# EAGLE schematic FDT_BIG_Jly21 (EAGLE 7.6.0)
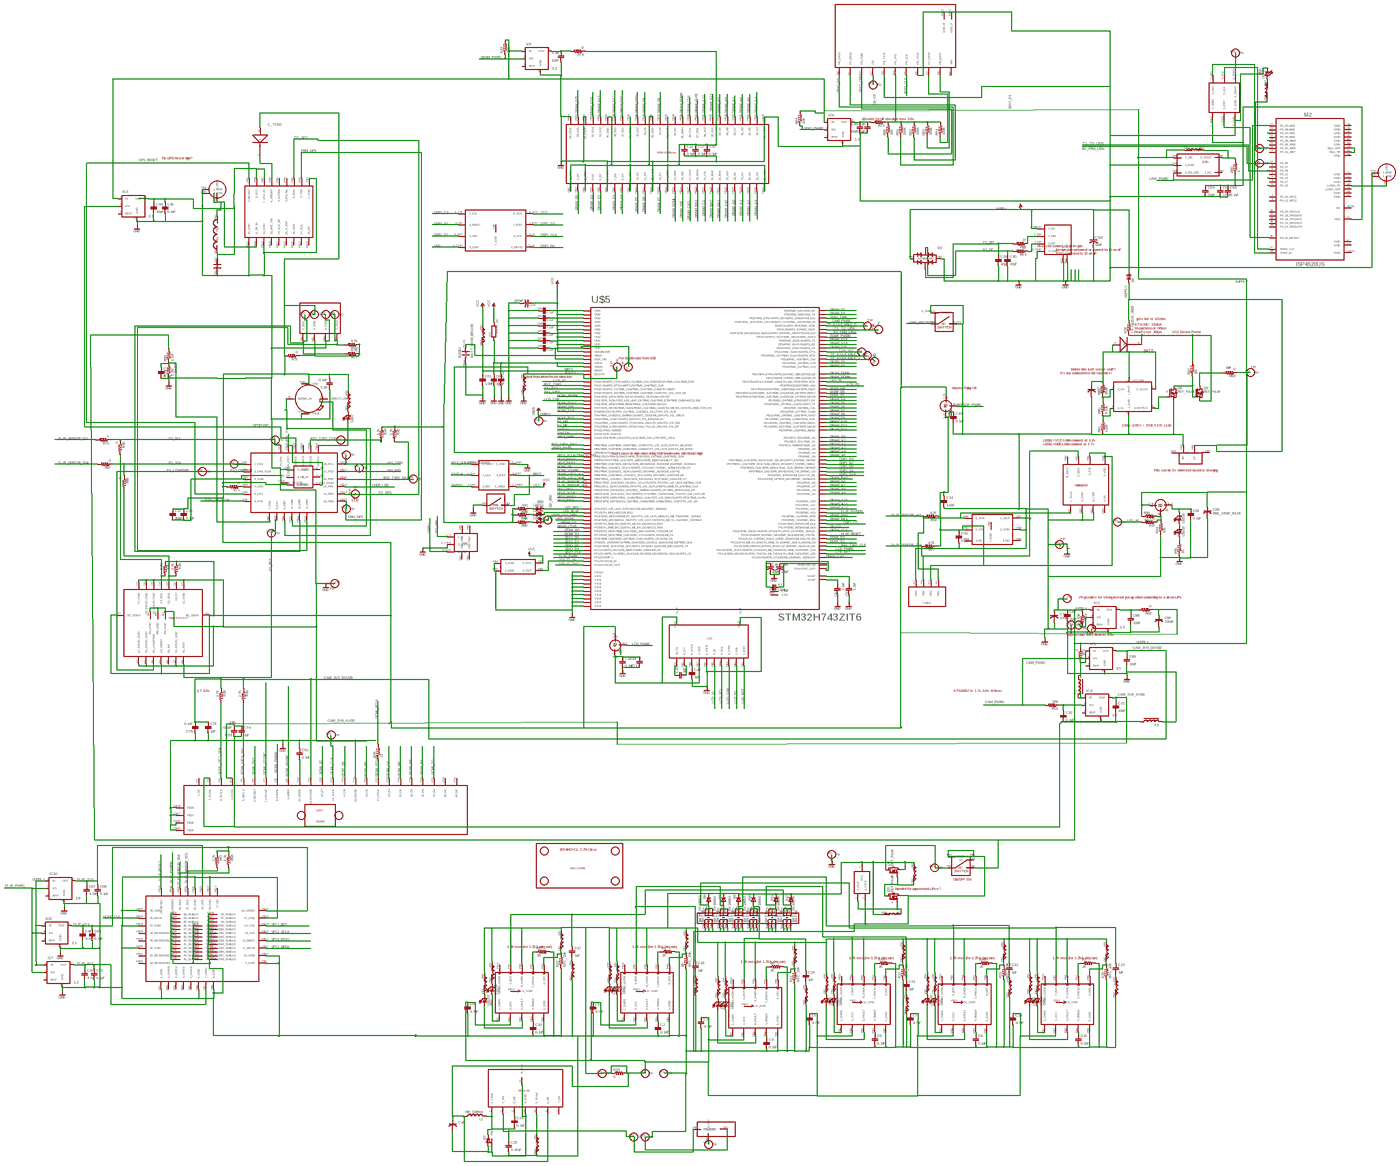
[diagram p0: schematic, sheet 1, overview]
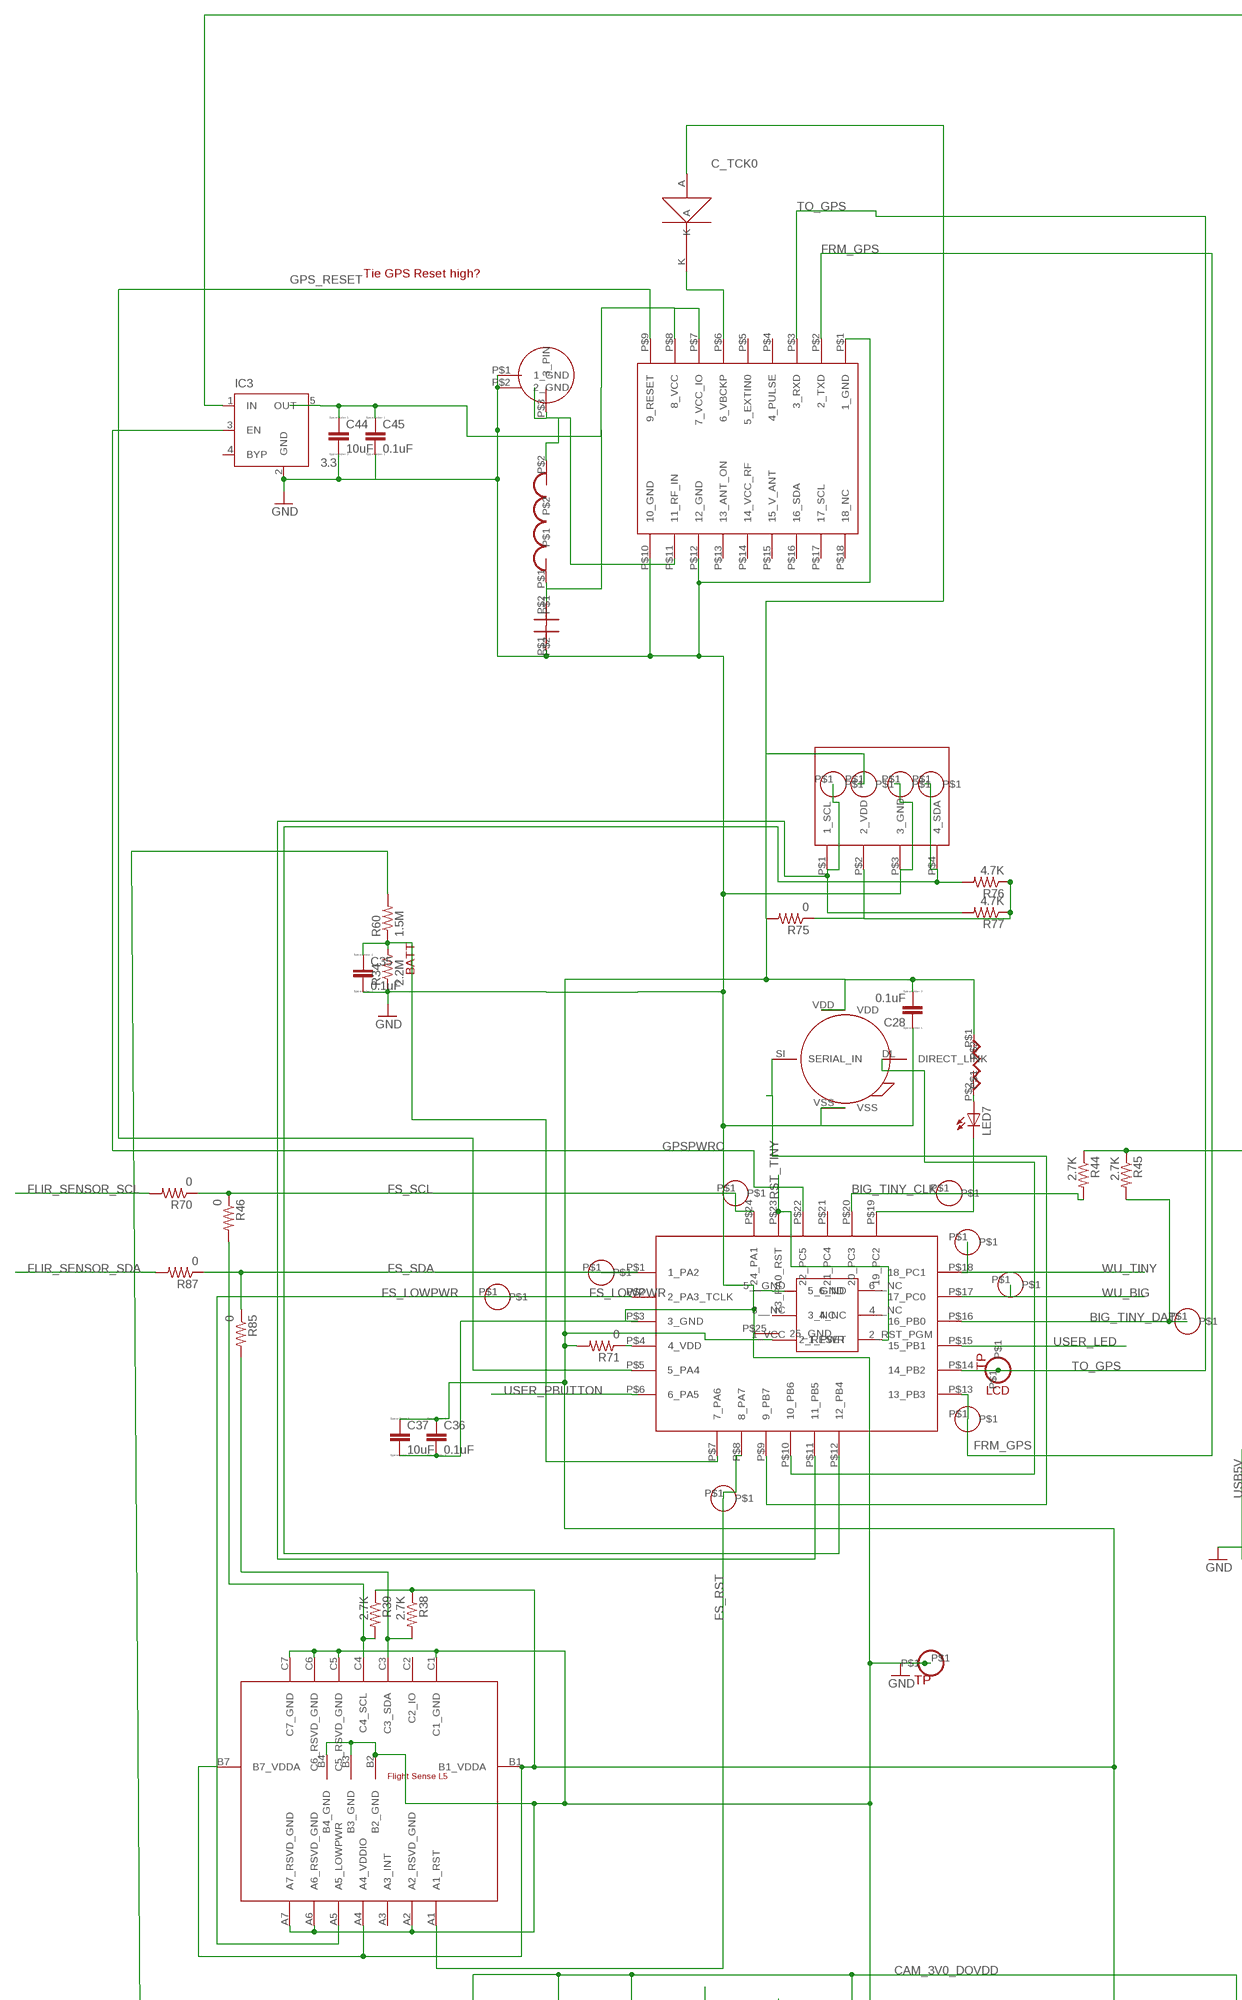
[diagram p1: schematic, sheet 1, part 1 of 6]
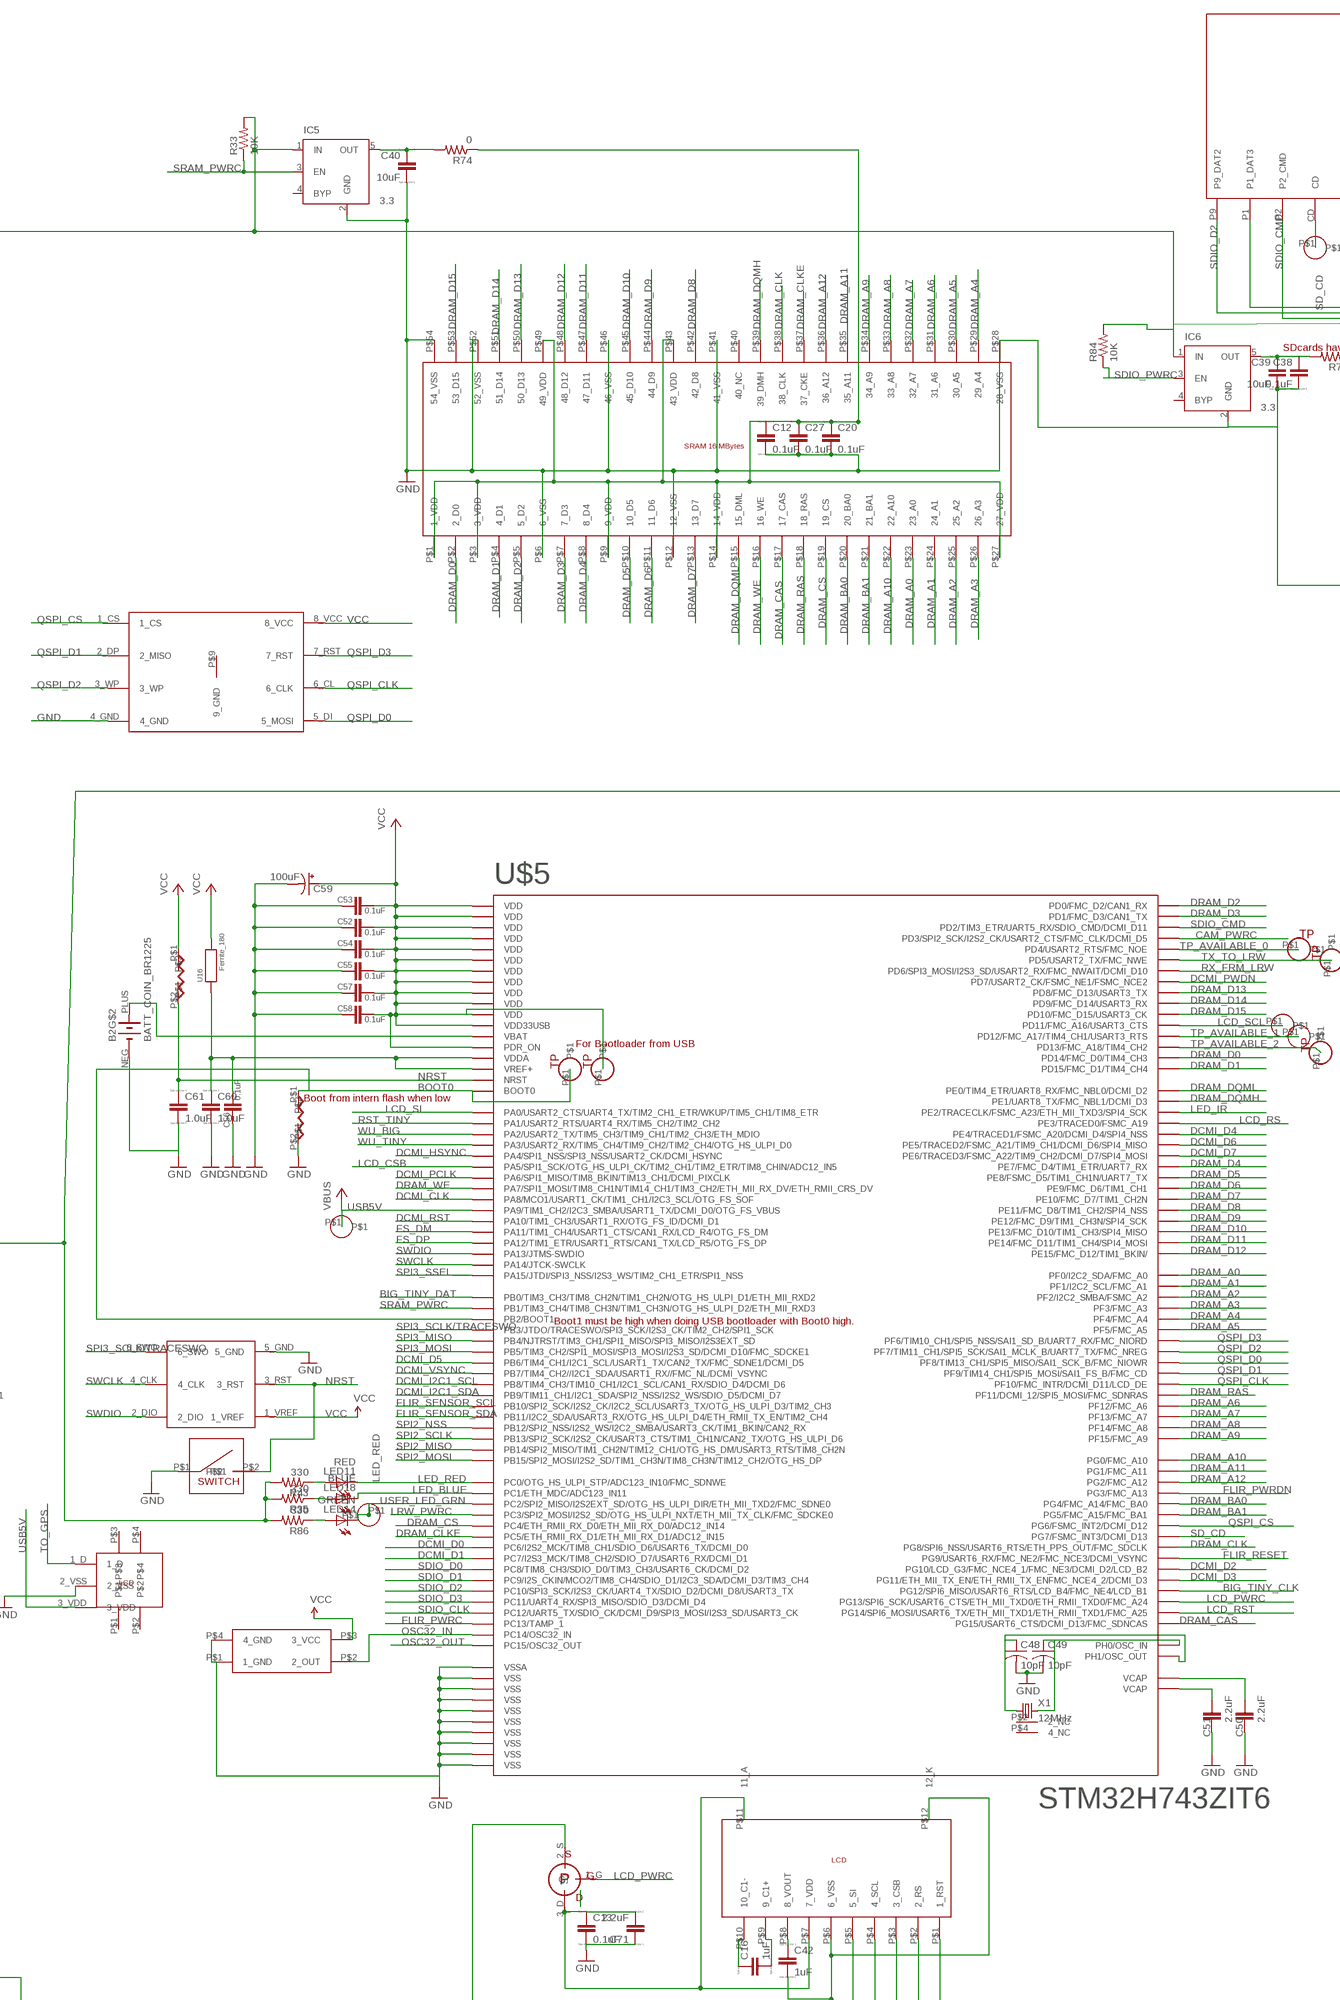
[diagram p2: schematic, sheet 1, part 2 of 6]
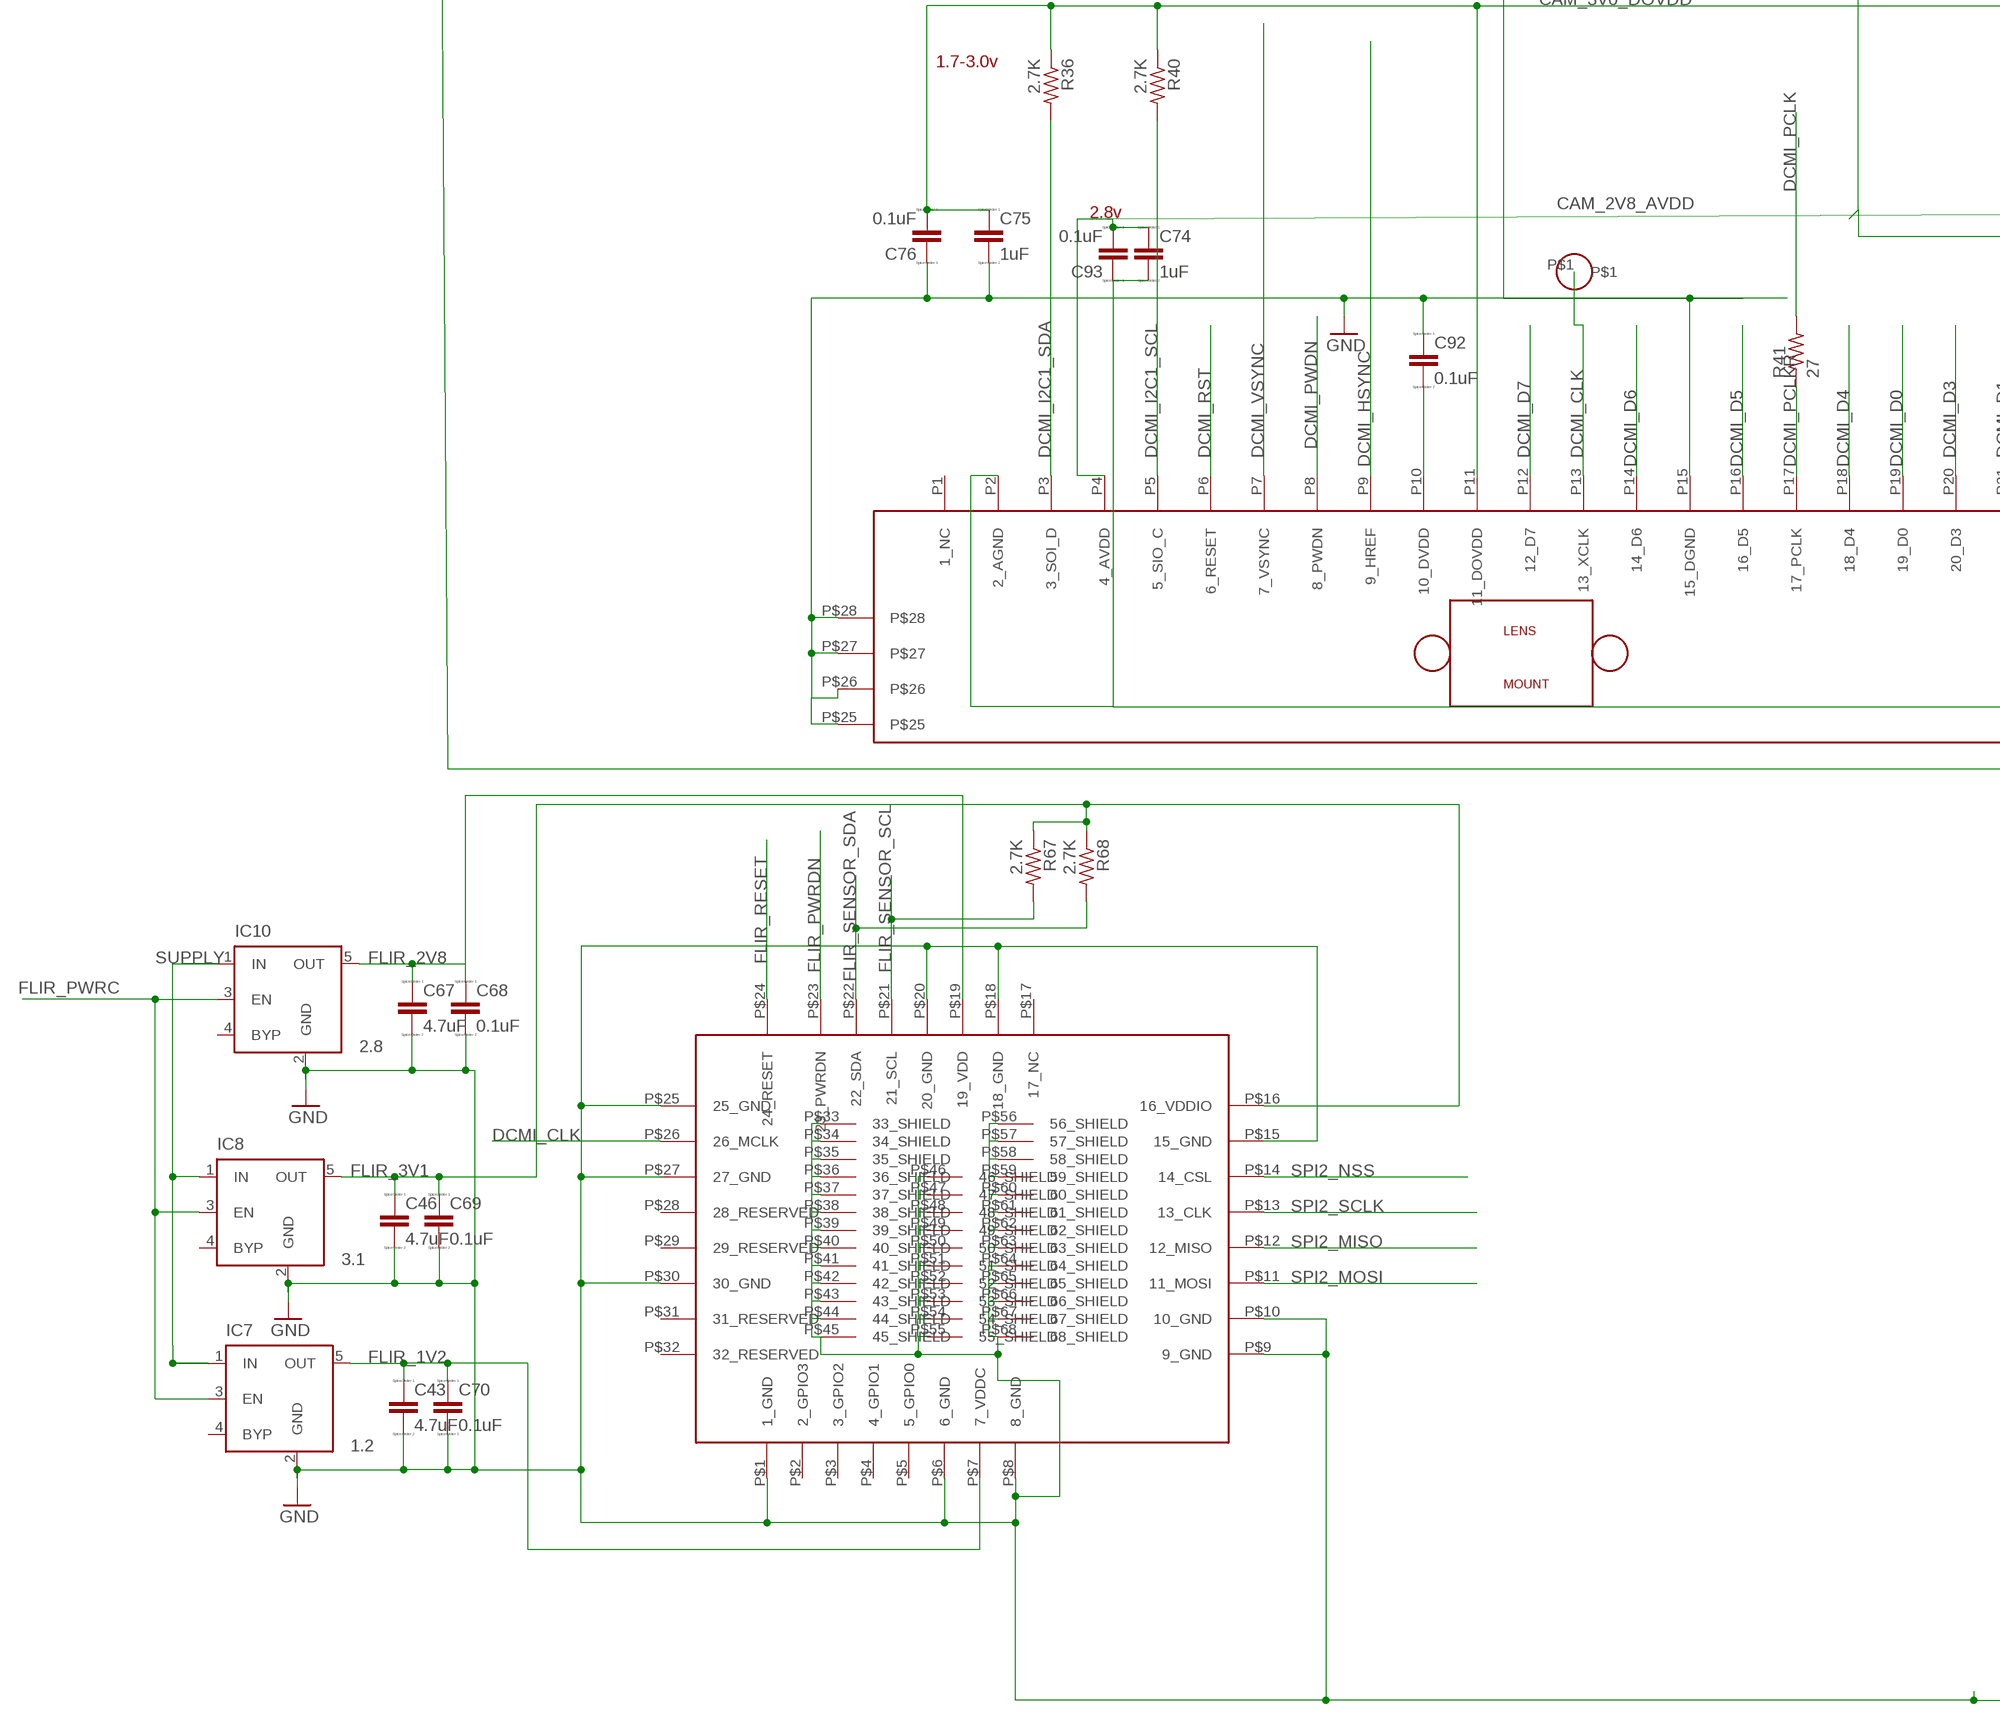
[diagram p3: schematic, sheet 1, part 3 of 6]
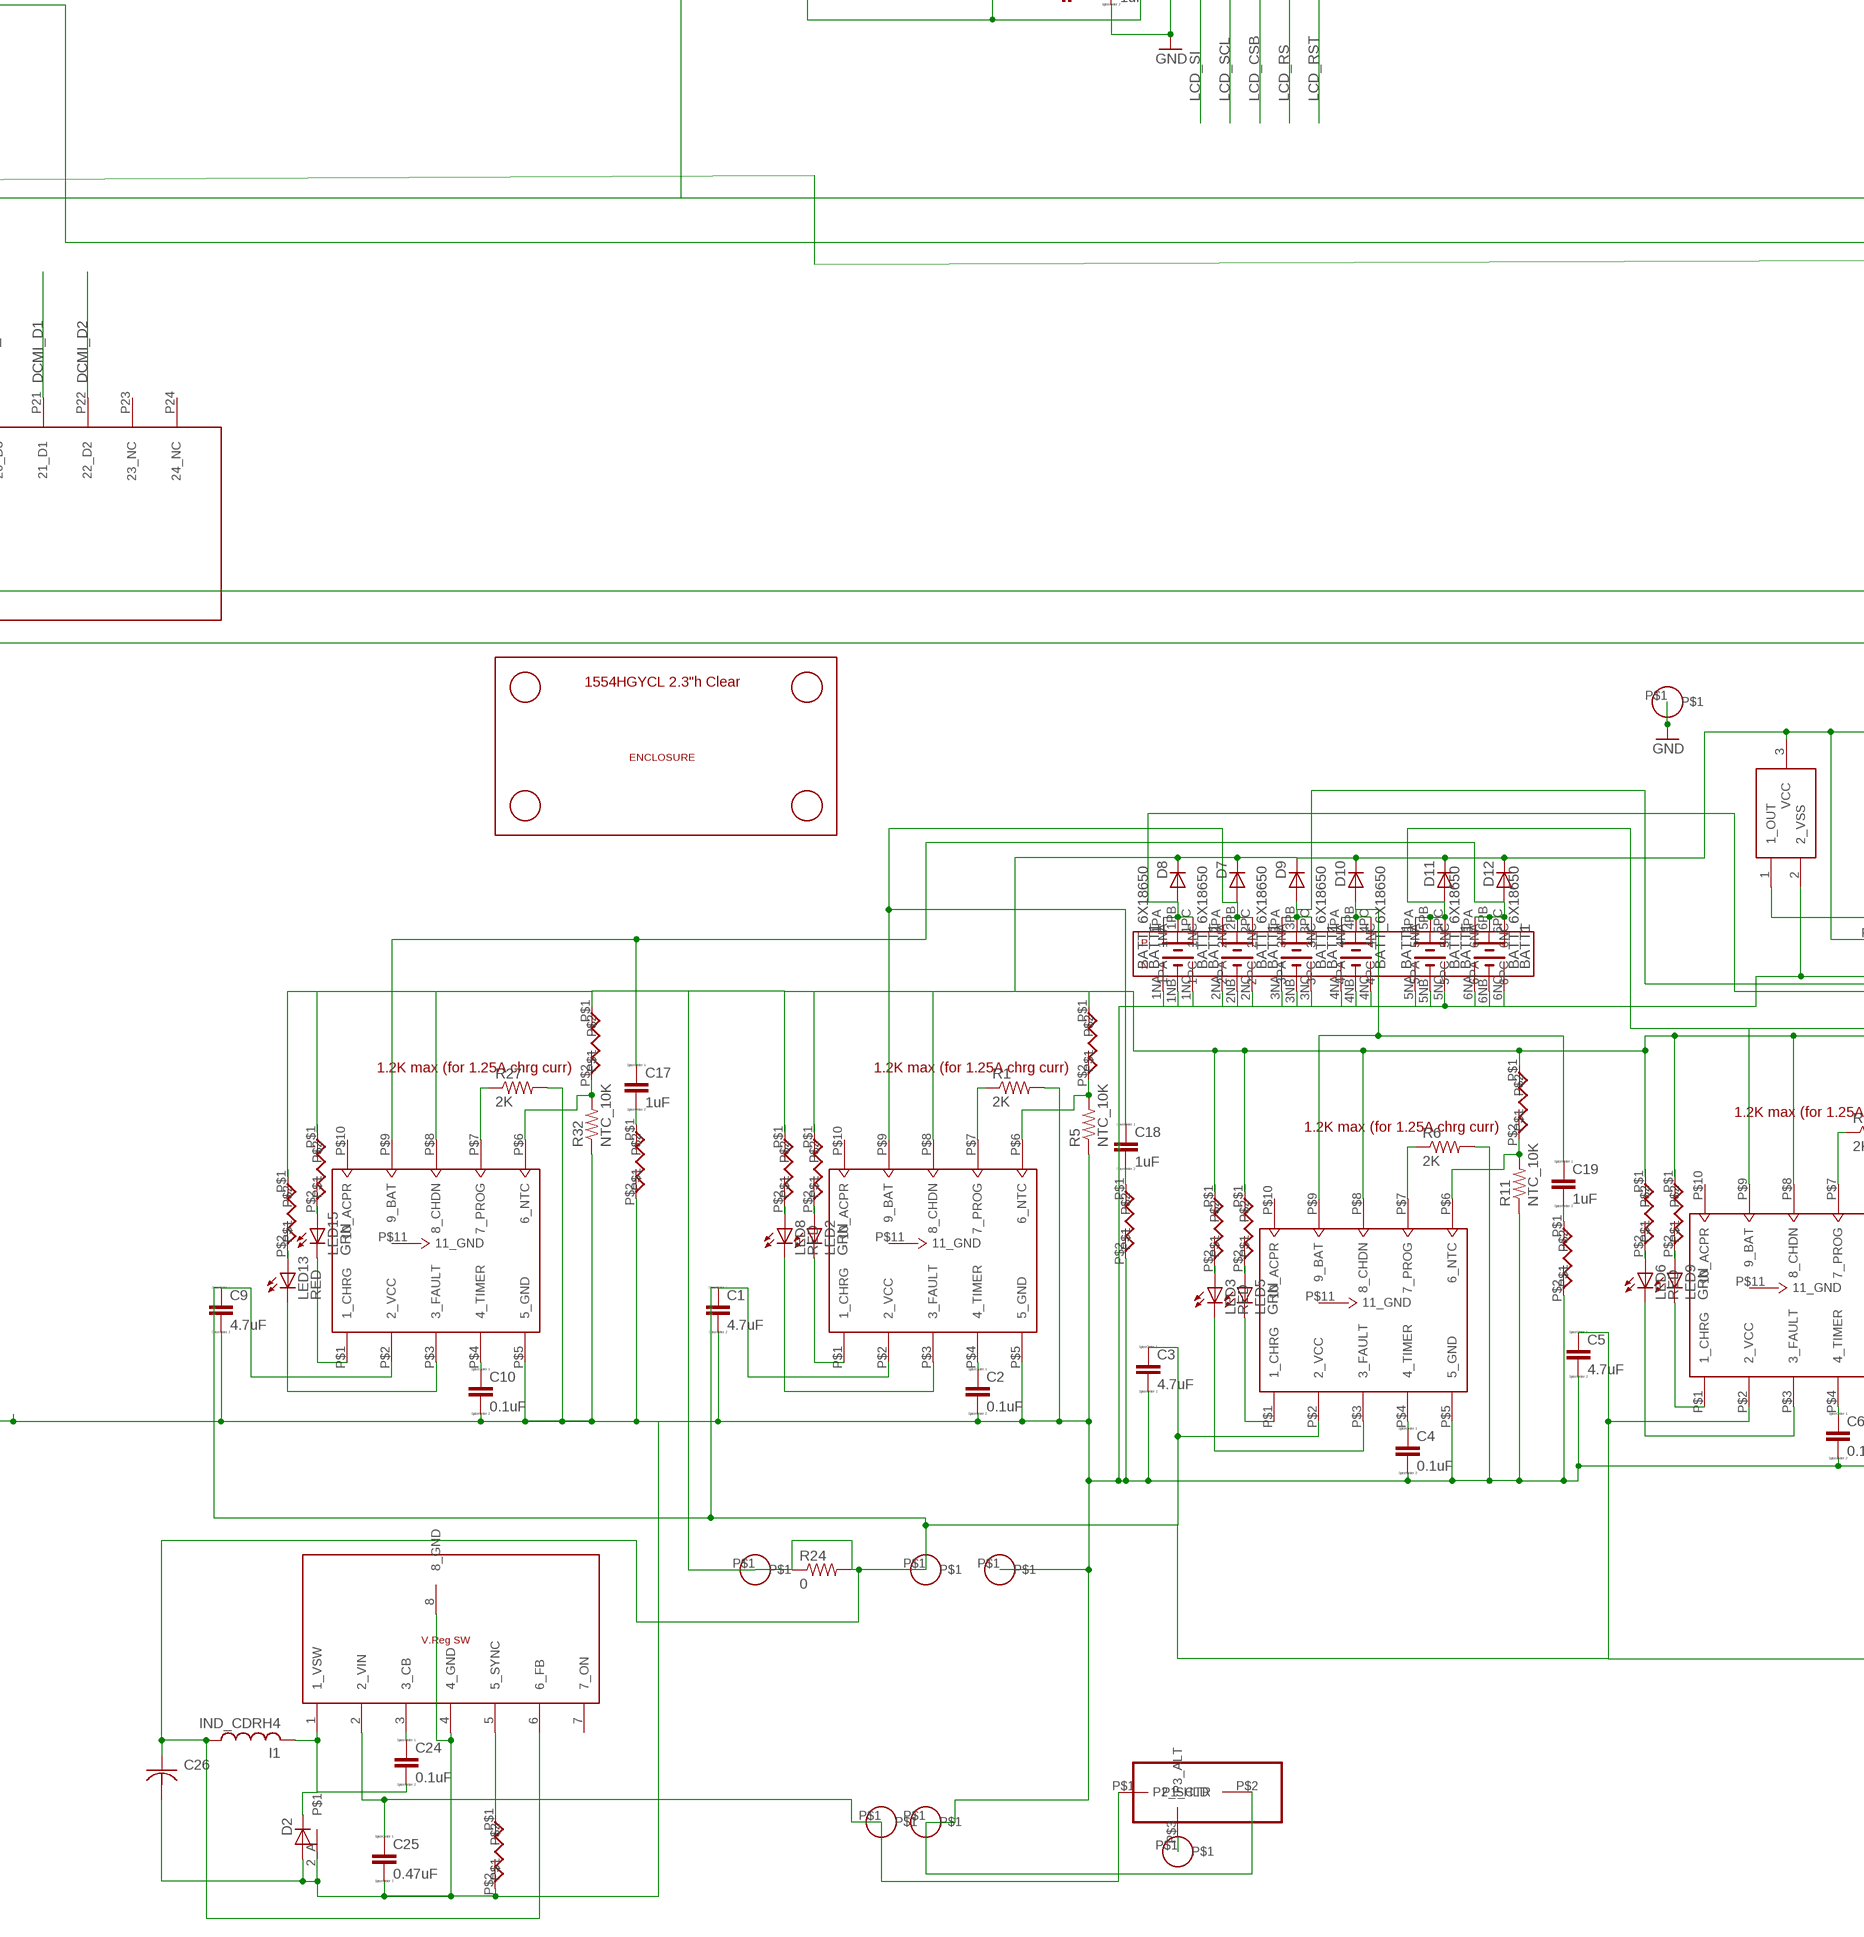
[diagram p4: schematic, sheet 1, part 4 of 6]
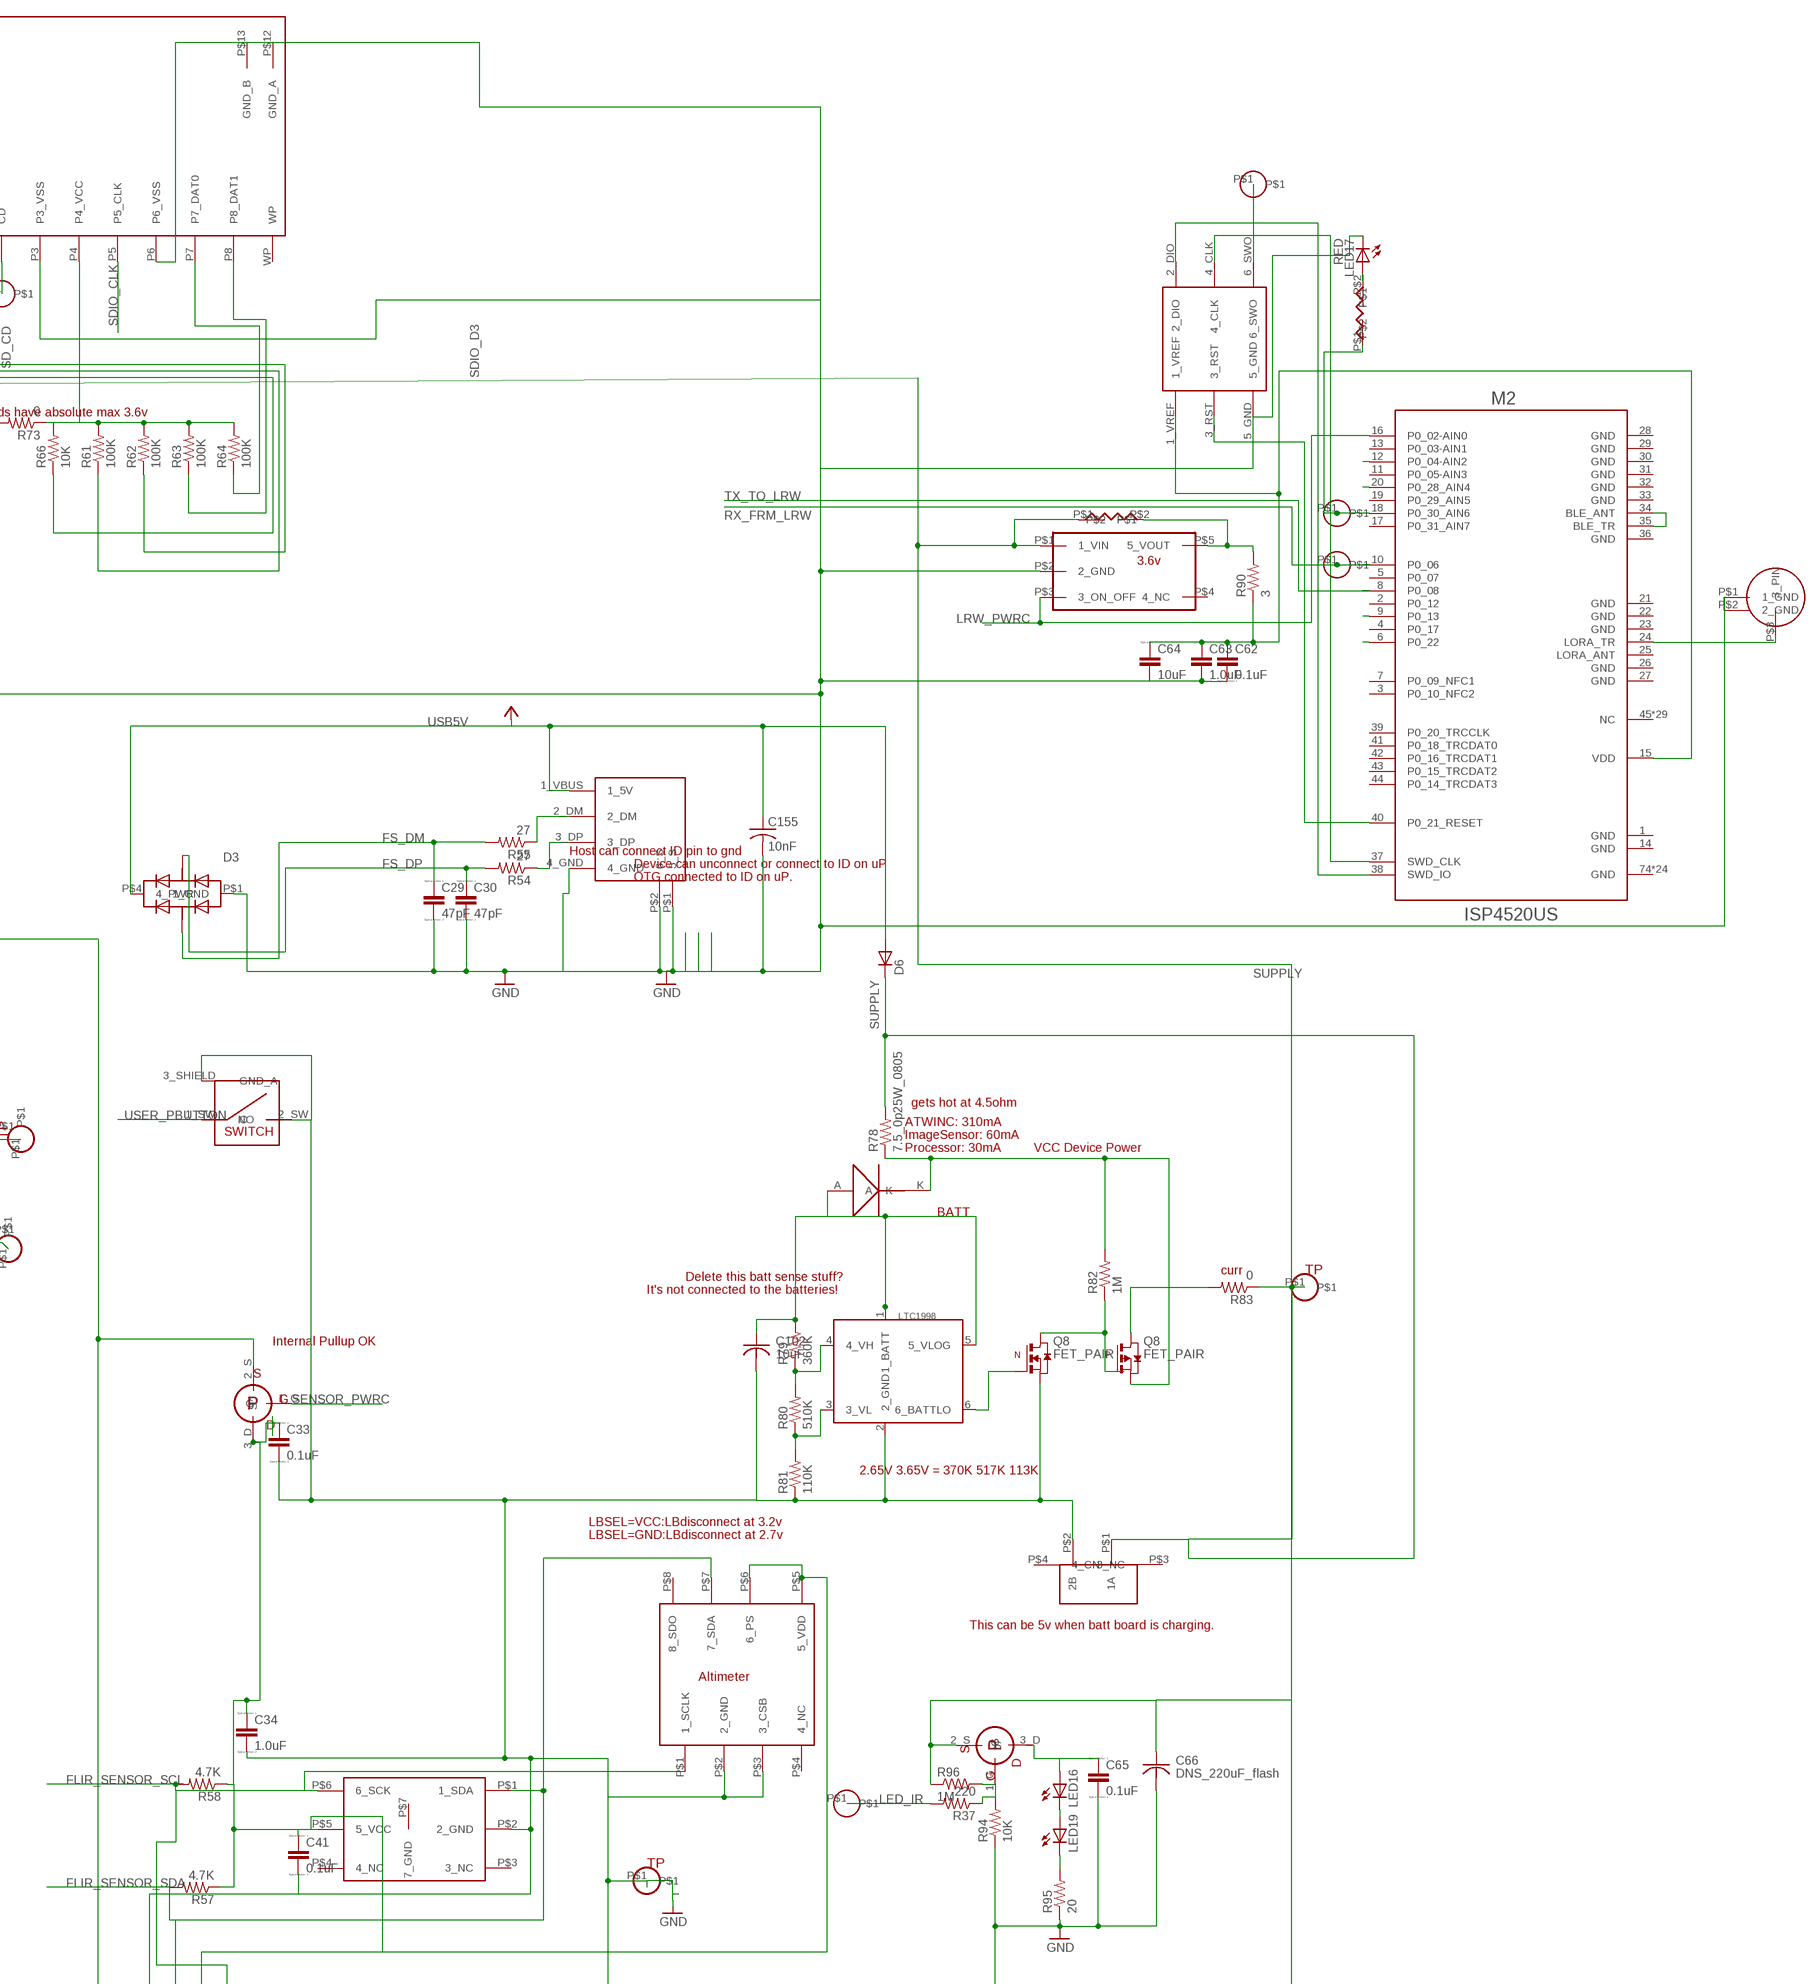
[diagram p5: schematic, sheet 1, part 5 of 6]
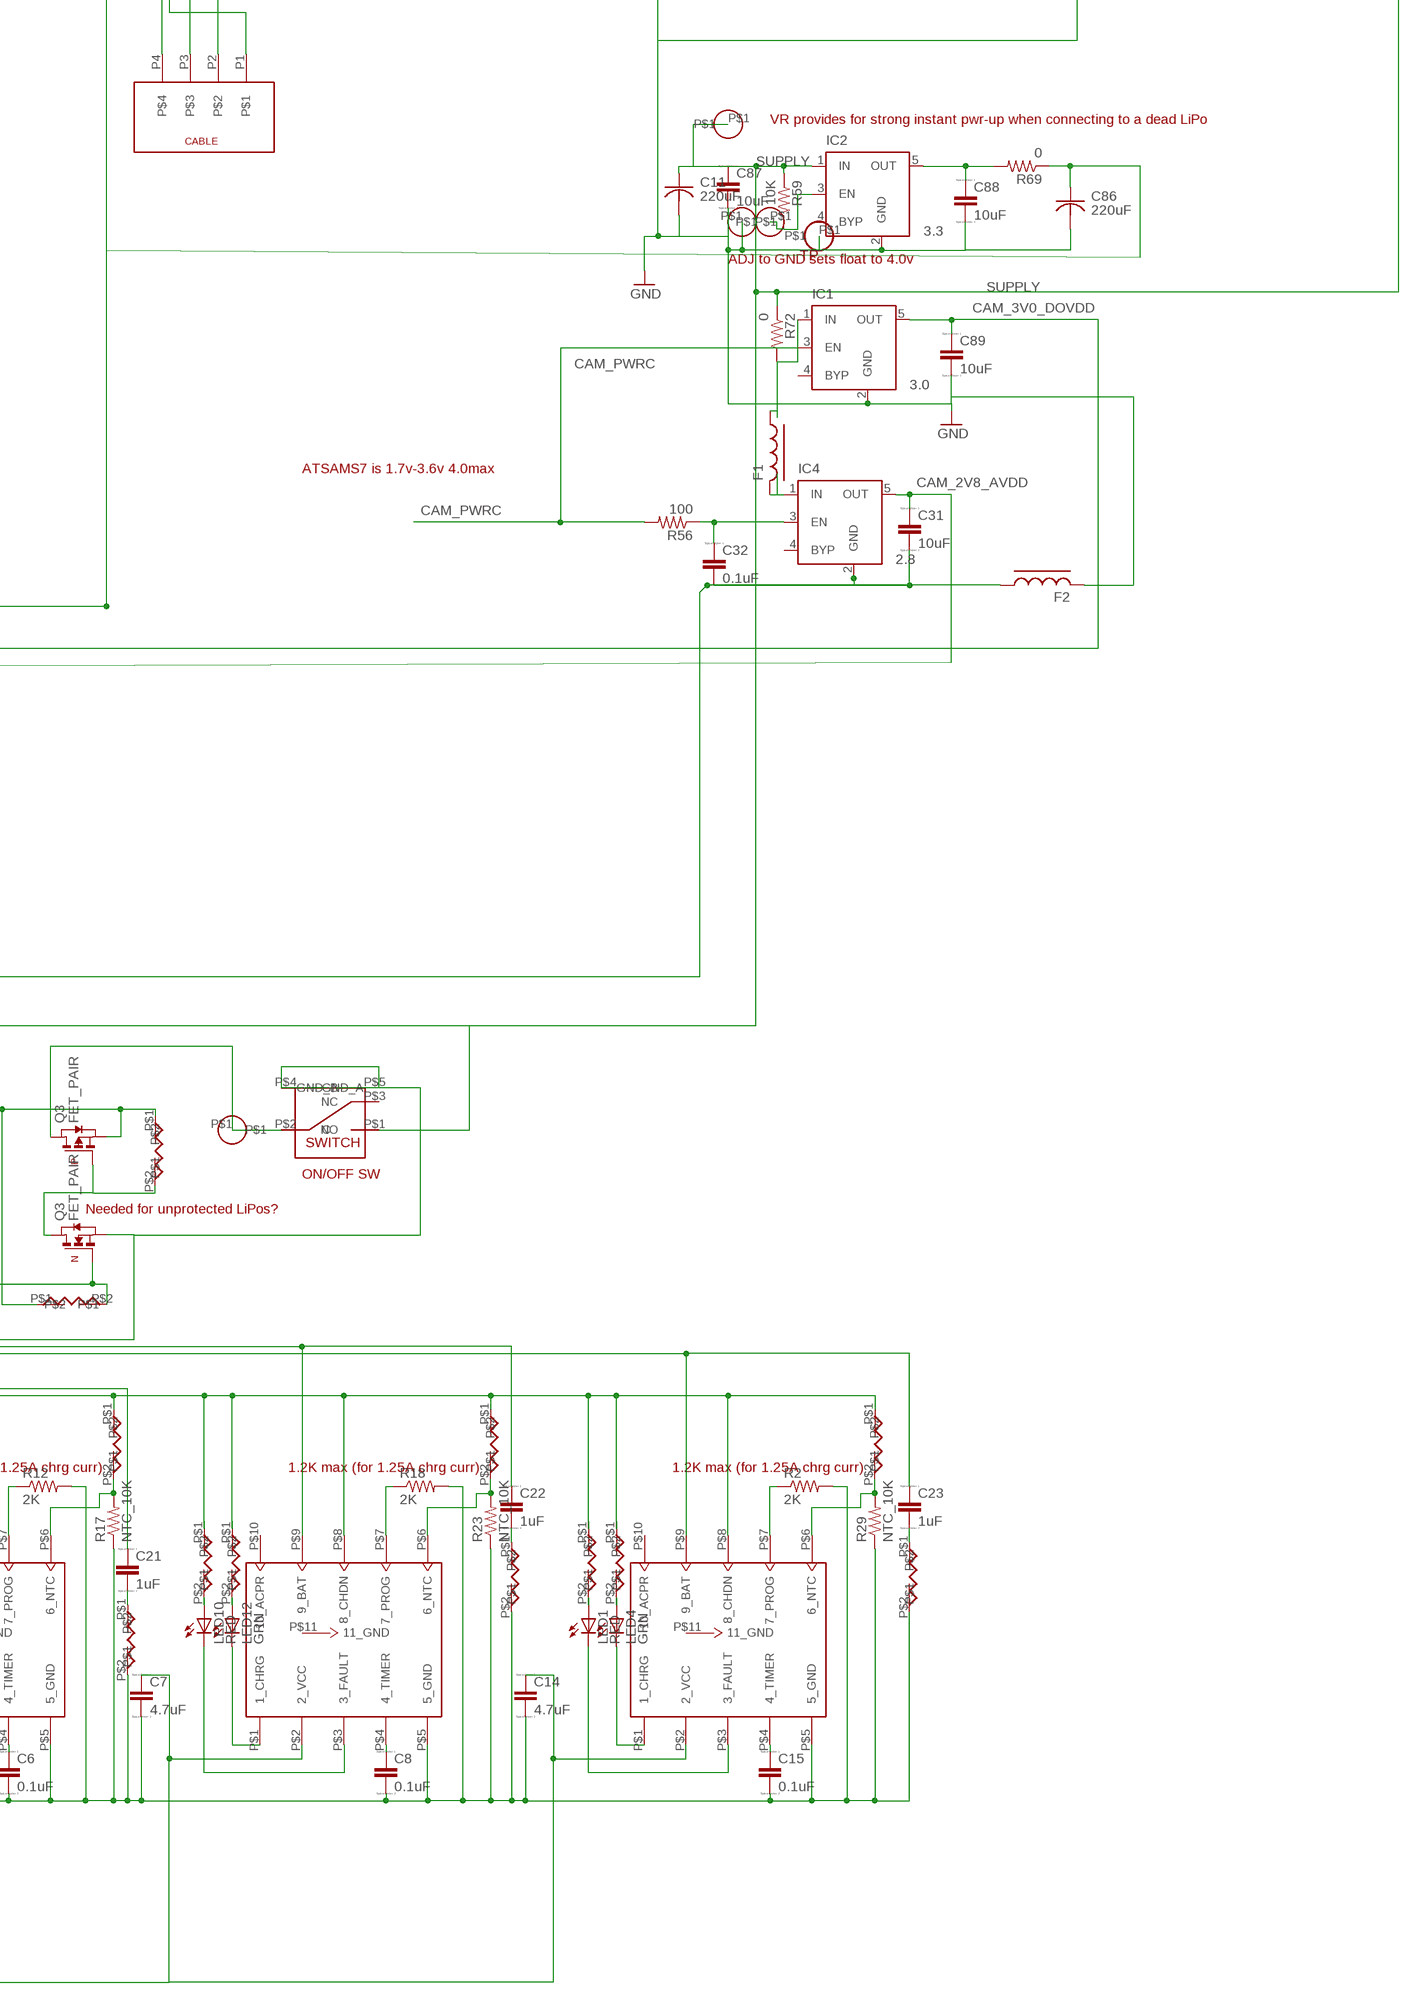
[diagram p6: schematic, sheet 1, part 6 of 6]

## Parts
B2  BATT_COIN_BR1225  [BATT_COIN_BR1225]
BATT1  BATT_6X18650  [BATT_HALFX6]
BOX1  ENCL_1554H  [ENCL_1554H]
C1  4.7uF  CAP_0603  [C0603]
C2  0.1uF  CAP_0402  [C0402]
C3  4.7uF  CAP_0603  [C0603]
C4  0.1uF  CAP_0402  [C0402]
C5  4.7uF  CAP_0603  [C0603]
C6  0.1uF  CAP_0402  [C0402]
C7  4.7uF  CAP_0603  [C0603]
C8  0.1uF  CAP_0402  [C0402]
C9  4.7uF  CAP_0603  [C0603]
C10  0.1uF  CAP_0402  [C0402]
C11  220uF  CAP_1210  [C1210K]
C12  0.1uF  CAP_0402  [C0402]
C13  0.1uF  CAP_0402  [C0402]
C14  4.7uF  CAP_0603  [C0603]
C15  0.1uF  CAP_0402  [C0402]
C16  1uF  CAP_0603  [C0603]
C17  1uF  CAP_0603  [C0603]
C18  1uF  CAP_0603  [C0603]
C19  1uF  CAP_0603  [C0603]
C20  0.1uF  CAP_0402  [C0402]
C21  1uF  CAP_0603  [C0603]
C22  1uF  CAP_0603  [C0603]
C23  1uF  CAP_0603  [C0603]
C24  0.1uF  CAP_0402  [C0402]
C25  0.47uF  CAP_0402  [C0402]
C26  CAP_1210  [C1210K]
C27  0.1uF  CAP_0402  [C0402]
C28  0.1uF  CAP_0402  [C0402]
C29  47pF  CAP_0402  [C0402]
C30  47pF  CAP_0402  [C0402]
C31  10uF  CAP_0603  [C0603]
C32  0.1uF  CAP_0402  [C0402]
C33  0.1uF  CAP_0402  [C0402]
C34  1.0uF  CAP_0603  [C0603]
C35  0.1uF  CAP_0402  [C0402]
C36  0.1uF  CAP_0402  [C0402]
C37  10uF  CAP_0603  [C0603]
C38  0.1uF  CAP_0402  [C0402]
C39  10uF  CAP_0603  [C0603]
C40  10uF  CAP_0603  [C0603]
C41  0.1uF  CAP_0402  [C0402]
C42  1uF  CAP_0603  [C0603]
C43  4.7uF  CAP_0603  [C0603]
C44  10uF  CAP_0603  [C0603]
C45  0.1uF  CAP_0402  [C0402]
C46  4.7uF  CAP_0603  [C0603]
C47  18pF  CAP_0402@2  [SMD_0402]
C48  10pF  CAP_0402_SM  [SMD_0402]
C49  10pF  CAP_0402_SM  [SMD_0402]
C50  2.2uF  CAP0603-CAP  [0603-CAP]
C51  2.2uF  CAP0603-CAP  [0603-CAP]
C52  0.1uF  CAP0402-CAP  [0402-CAP]
C53  0.1uF  CAP0402-CAP  [0402-CAP]
C54  0.1uF  CAP0402-CAP  [0402-CAP]
C55  0.1uF  CAP0402-CAP  [0402-CAP]
C56  0.1uF  CAP0402-CAP  [0402-CAP]
C57  0.1uF  CAP0402-CAP  [0402-CAP]
C58  0.1uF  CAP0402-CAP  [0402-CAP]
C59  100uF  CAP_POL1206  [EIA3216]
C60  1.0uF  CAP_0603  [C0603]
C61  1.0uF  CAP_0603  [C0603]
C62  0.1uF  CAP_0402  [C0402]
C63  1.0uF  CAP_0603  [C0603]
C64  10uF  CAP_0603  [C0603]
C65  0.1uF  CAP_0402  [C0402]
C66  DNS_220uF_flash  CAP_1210  [C1210K]
C67  4.7uF  CAP_0603  [C0603]
C68  0.1uF  CAP_0402  [C0402]
C69  0.1uF  CAP_0402  [C0402]
C70  0.1uF  CAP_0402  [C0402]
C71  2.2uF  CAP_0603  [C0603]
C74  1uF  CAP_0603  [C0603]
C75  1uF  CAP_0603  [C0603]
C76  0.1uF  CAP_0402  [C0402]
C86  220uF  CAP_1210  [C1210K]
C87  10uF  CAP_0603  [C0603]
C88  10uF  CAP_0603  [C0603]
C89  10uF  CAP_0603  [C0603]
C92  0.1uF  CAP_0402  [C0402]
C93  0.1uF  CAP_0402  [C0402]
C102  10uF  CAP0805ELEC  [C0805ELEC]
C155  10nF  CAP_0402_SM  [SMD_0402]
D2  DIODE_BIG  [DIODE_BIG]
D3  ESD_SM  [TVSDIODE]
D4  DIO_SCH  [SOD323]
D5  DIO_SCH  [SOD323]
D6  DIODE_SCHTKY  [SOD323]
D7  DIODE_SCHTKY  [SOD323]
D8  DIODE_SCHTKY  [SOD323]
D9  DIODE_SCHTKY  [SOD323]
D10  DIODE_SCHTKY  [SOD323]
D11  DIODE_SCHTKY  [SOD323]
D12  DIODE_SCHTKY  [SOD323]
F1  FERRITE_0603  [R0603]
F2  FERRITE_0603  [R0603]
G1  GPS_ANT  [GPS_ANTE]
G2  GPS_ANT  [GPS_ANTE]
I1  IND_CDRH4  [IND_CDRH4D]
IC1  3.0  MIC5219XX  [SOT23-5]
IC2  3.3  MIC5219XX  [SOT23-5]
IC3  3.3  MIC5219XX  [SOT23-5]
IC4  2.8  MIC5219XX  [SOT23-5]
IC5  3.3  MIC5219XX  [SOT23-5]
IC6  3.3  MIC5219XX  [SOT23-5]
IC7  1.2  MIC5219XX  [SOT23-5]
IC8  3.1  MIC5219XX  [SOT23-5]
IC10  2.8  MIC5219XX  [SOT23-5]
IR1  FLIR_LEPTOP_SOCKET  [FLIR_SOCKET]
J2  CONN_FPC_24P  [CONN_FPC_24PIN]
J3  USB_B_SMT_HORIZ  [USB_B_SMT_HORIZ]
J4  HDR_SEGER_6P  [HDR_SEGGER_6P]
J5  HDR_PGM_TINY_SMT  [HDR_PGM_TINY_SMT]
J6  CONN_4PCABLE_VERT  [CONN_4PCABLE]
J7  CONN_2PCABLE_SMT  [CONN_2PCABLE_SMT]
J8  HDR_SEGER_6P  [HDR_SEGGER_6P]
J9  PWR_JAC4  [PWR_JAC4]
L5  100nH  IND_SMD  [SMD_IND]
LCD1  LCD_NHD_3PIN  [LCD_NHD_3PINS]
LED1  RED  LEDCHIP-LED0603  [CHIP-LED0603]
LED2  GRN  LEDCHIP-LED0603  [CHIP-LED0603]
LED3  RED  LEDCHIP-LED0603  [CHIP-LED0603]
LED4  GRN  LEDCHIP-LED0603  [CHIP-LED0603]
LED5  GRN  LEDCHIP-LED0603  [CHIP-LED0603]
LED6  RED  LEDCHIP-LED0603  [CHIP-LED0603]
LED7  LEDCHIP-LED0603  [CHIP-LED0603]
LED8  RED  LEDCHIP-LED0603  [CHIP-LED0603]
LED9  GRN  LEDCHIP-LED0603  [CHIP-LED0603]
LED10  RED  LEDCHIP-LED0603  [CHIP-LED0603]
LED11  RED  LEDCHIP-LED0603  [CHIP-LED0603]
LED12  GRN  LEDCHIP-LED0603  [CHIP-LED0603]
LED13  RED  LEDCHIP-LED0603  [CHIP-LED0603]
LED14  GREEN  LED_RA_SM  [LED_RA_SM]
LED15  GRN  LEDCHIP-LED0603  [CHIP-LED0603]
LED16  LED5MM  [LED5MM]
LED17  RED  LEDCHIP-LED0603  [CHIP-LED0603]
LED18  BLUE  LED_RA_SM  [LED_RA_SM]
LED19  LED5MM  [LED5MM]
LM2  LENS_MOUNT_CMT107  [LENS_MOUNT_CMT107]
M2  ISP4520US  [ISP4520-LGA-QFN74-9.8X17.2X1.7MM]
PIR2  PIR_DUAL_4P  [PIR_4P]
Q1  MOSFET_P  [SOT23_PFET]
Q2  MOSFET_P  [SOT23_PFET]
Q3  FET_PAIR  [SSOT6]
Q5  MOSFET_P  [SOT23_PFET]
Q8  FET_PAIR  [SSOT6]
R1  2K  RES_0402  [SMD_0402]
R2  2K  RES_0402  [SMD_0402]
R3  1K  RES_0402  [SMD_0402]
R4  4k  RES_0402  [SMD_0402]
R5  NTC_10K  R-US_R0603  [R0603]
R6  2K  RES_0402  [SMD_0402]
R7  1K  RES_0402  [SMD_0402]
R8  1K  RES_0402  [SMD_0402]
R9  1K  RES_0402  [SMD_0402]
R10  4k  RES_0402  [SMD_0402]
R11  NTC_10K  R-US_R0603  [R0603]
R12  2K  RES_0402  [SMD_0402]
R13  1K  RES_0402  [SMD_0402]
R14  1K  RES_0402  [SMD_0402]
R15  1K  RES_0402  [SMD_0402]
R16  4k  RES_0402  [SMD_0402]
R17  NTC_10K  R-US_R0603  [R0603]
R18  2K  RES_0402  [SMD_0402]
R19  1K  RES_0402  [SMD_0402]
R20  4k  RES_0402  [SMD_0402]
R21  1K  RES_0402  [SMD_0402]
R22  4k  RES_0402  [SMD_0402]
R23  NTC_10K  R-US_R0603  [R0603]
R24  0  RES_0402  [SMD_0402]
R25  1M  RES_0402  [SMD_0402]
R26  1M  RES_0402  [SMD_0402]
R27  2K  RES_0402  [SMD_0402]
R28  1K  RES_0402  [SMD_0402]
R29  NTC_10K  R-US_R0603  [R0603]
R30  1K  RES_0402  [SMD_0402]
R31  4k  RES_0402  [SMD_0402]
R32  NTC_10K  R-US_R0603  [R0603]
R33  10K  R0402  [R0402]
R34  2.2M  R0402  [R0402]
R35  330  R0402  [R0402]
R36  2.7K  RES_0402  [SMD_0402]
R37  220  R0402  [R0402]
R38  2.7K  RES_0402  [SMD_0402]
R39  2.7K  RES_0402  [SMD_0402]
R40  2.7K  RES_0402  [SMD_0402]
R41  27  RES_0402  [SMD_0402]
R42  330  RES_0402  [SMD_0402]
R43  330  R0402  [R0402]
R44  2.7K  RES_0402  [SMD_0402]
R45  2.7K  RES_0402  [SMD_0402]
R46  0  R0402  [R0402]
R47  1ohm  RES_0402  [SMD_0402]
R48  1ohm  RES_0402  [SMD_0402]
R49  1ohm  RES_0402  [SMD_0402]
R50  1ohm  RES_0402  [SMD_0402]
R51  1ohm  RES_0402  [SMD_0402]
R52  1ohm  RES_0402  [SMD_0402]
R53  1K  RES_0402  [SMD_0402]
R54  27  R0402  [R0402]
R55  27  R0402  [R0402]
R56  100  R0402  [R0402]
R57  4.7K  R0402  [R0402]
R58  4.7K  R0402  [R0402]
R59  10K  R0402  [R0402]
R60  1.5M  R0402  [R0402]
R61  100K  R0402  [R0402]
R62  100K  R0402  [R0402]
R63  100K  R0402  [R0402]
R64  100K  R0402  [R0402]
R65  1K  RES_0402  [SMD_0402]
R66  10K  R0402  [R0402]
R67  2.7K  RES_0402  [SMD_0402]
R68  2.7K  RES_0402  [SMD_0402]
R69  0  R0402  [R0402]
R70  0  R0402  [R0402]
R71  0  R0402  [R0402]
R72  0  R0402  [R0402]
R73  0  R0402  [R0402]
R74  0  R0402  [R0402]
R75  0  R0402  [R0402]
R76  4.7K  R0402  [R0402]
R77  4.7K  R0402  [R0402]
R78  7.5_0p25W_0805  R-US_M0805  [M0805]
R79  360K  R0402  [R0402]
R80  510K  R0402  [R0402]
R81  110K  R0402  [R0402]
R82  1M  R0402  [R0402]
R83  0  R0402  [R0402]
R84  10K  R0402  [R0402]
R85  0  R0402  [R0402]
R86  330  R0402  [R0402]
R87  0  R0402  [R0402]
R88  10K  RES_0402  [SMD_0402]
R89  10K  RES_0402  [SMD_0402]
R90  3  R0402  [R0402]
R91  DNS_0  RES_0402  [SMD_0402]
R92  1K  RES_0402  [SMD_0402]
R94  10K  R0402  [R0402]
R95  20  R0402  [R0402]
R96  1M  R0402  [R0402]
SD1  SD_CARD  [SD_CARD]
SW1  SWITH_NO  [SW_SQ]
SW2  SWITCH_TOG_RA  [SW_TOG_RA]
SW3  SW_PBUTTON_RA  [SW_PBUTTON_RA]
T1  TESTP_SM  [TESTP_SM]
T2  TESTP_SM  [TESTP_SM]
T3  TESTP_SM  [TESTP_SM]
T4  TESTP_SM  [TESTP_SM]
T5  TESTP_SM  [TESTP_SM]
T6  TESTP_SM  [TESTP_SM]
T7  TESTP_SM  [TESTP_SM]
T8  TESTP_SM  [TESTP_SM]
T12  TESTP_SM  [TESTP_SM]
T13  TESTP_SM  [TESTP_SM]
TP1  TP_THSM2  [TP_THSM2]
TP2  TP_THSM2  [TP_THSM2]
TP3  TP_THSM2  [TP_THSM2]
TP4  TP_THSM2  [TP_THSM2]
TP5  TP_THSM2  [TP_THSM2]
TP6  TP_THSM2  [TP_THSM2]
TP7  TP_THSM2  [TP_THSM2]
TP8  TP_SMT  [TP_SMT]
TP9  TP_SMT  [TP_SMT]
TP10  TP_SMT  [TP_SMT]
TP11  TP_THSM  [TP_THSM]
TP12  TP_THSM  [TP_THSM]
TP13  TP_THSM  [TP_THSM]
TP14  TP_THSM2  [TP_THSM2]
TP15  TP_THSM  [TP_THSM]
TP16  TP_THSM2  [TP_THSM2]
TP17  TP_THSM2  [TP_THSM2]
TP18  TP_SMT  [TP_SMT]
TP19  TP_SMT  [TP_SMT]
TP20  TP_SMT  [TP_SMT]
TP21  TP_SMT  [TP_SMT]
TP22  TP_SMT  [TP_SMT]
TP23  TP_SMT  [TP_SMT]
TP24  TP_THSM2  [TP_THSM2]
TP25  TP_SMT  [TP_SMT]
TP26  TP_SMT  [TP_SMT]
TP27  TP_SMT  [TP_SMT]
TP29  TP_SMT  [TP_SMT]
TP31  TP_SMT  [TP_SMT]
TP32  TP_SMT  [TP_SMT]
TP41  TP_SMT  [TP_SMT]
TP42  TP_SMT  [TP_SMT]
TP43  TP_SMT  [TP_SMT]
TP46  TP_SMT  [TP_SMT]
U1  LTC4053  [LTC4053]
U2  LTC4053  [LTC4053]
U3  LTC4053  [LTC4053]
U4  LTC4053  [LTC4053]
U5  LTC4053  [LTC4053]
U6  HUMIDITY_A  [HUMIDITY_A]
U7  VOLT_SUPR  [TO236]
U8  FLIGHTSENSE_L5  [FLIGHT_SENSE_L5]
U10  LTC4053  [LTC4053]
U11  VREG_SW_LM2677  [TO263-7]
U12  SRAM_16M_2X16  [TSOP_54]
U13  ALS  [ALS]
U15  UBLOX_M8  [UBLOX_M8]
U16  Ferrite_180  BEAD  [0402-CAP]
U17  FLASH_SPI  [WSON_8]
U18  3.6v  VREG_23B  [SOT_235B]
U19  LTC1998  [SOT23-6L]
U20  ALTIMETER_TEC  [ALTIMETER_TEC]
U24  ATTINY_817_QFN  [QFN24]
U$1  LCD_3V_SMALL  [LCD_3V_SMALL]
U$5  STM32H743ZIT6  [LQFP144@1]
X1  12MHz  XTAL_SMALL  [XTAL_SMALL]
X2  TCXO_32K_BGA  [TCXO_32K_BGA]

## Nets
5VREG_OUT: C1.1 C3.1 C5.1 C7.1 C9.1 C14.1 C26.1(1P) D7.1_K(K) D8.1_K(K) D9.1_K(K) D10.1_K(K) D11.1_K(K) D12.1_K(K) I1.P$3 Q3.2(P_S) R3.P$1 R4.P$1 R7.P$1 R8.P$1 R9.P$1 R10.P$1 R13.P$1 R14.P$1 R15.P$1 R16.P$1 R19.P$1 R20.P$1 R21.P$1 R22.P$1 R24.P$1 R24.P$2 R25.P$1 R26.P$1 R28.P$1 R30.P$1 R31.P$1 R65.P$1 TP2.P$1 TP4.P$1 U1.P$2(2_VCC) U1.P$8(8_CHDN) U2.P$2(2_VCC) U2.P$8(8_CHDN) U3.P$2(2_VCC) U3.P$8(8_CHDN) U4.P$2(2_VCC) U4.P$8(8_CHDN) U5.P$2(2_VCC) U5.P$8(8_CHDN) U7.3(VCC) U10.P$2(2_VCC) U10.P$8(8_CHDN) U11.6(6_FB)
AGND: C31.2 C32.2 C74.2 C93.1 F2.1 IC4.2(GND) J2.P2(2_AGND)
BATT: C102.1P D5.A R79.2 U19.1(1_BATT) U19.5(5_VLOG)
BIG_TINY_CLK: R44.P$2 TP29.P$1 U24.P$20(20_PC3) U$5.127(PG12/SPI6_MISO/USART6_RTS/LCD_B4/FMC_NE4/LCD_B1)
BIG_TINY_DAT: R45.P$2 TP27.P$1 U24.P$16(16_PB0) U$5.46(PB0/TIM3_CH3/TIM8_CH2N/TIM1_CH2N/OTG_HS_ULPI_D1/ETH_MII_RXD2)
BOOT0: R89.P$1 T7.P$1 U$5.48(PB2/BOOT1) U$5.138(BOOT0)
CAM_2V8_AVDD: C31.1 C74.1 C93.2 IC4.5(OUT) J2.P4(4_AVDD)
CAM_3V0_DOVDD: C75.1 C76.2 C89.1 IC1.5(OUT) J2.P11(11_DOVDD) R36.P$1 R40.P$1
CAM_PWRC: IC1.3(EN) R56.2 U$5.117(PD3/SPI2_SCK/I2S2_CK/USART2_CTS/FMC_CLK/DCMI_D5)
DCMI_CLK: IR1.P$26(26_MCLK) J2.P13(13_XCLK) TP25.P$1 U$5.100(PA8/MCO1/USART1_CK/TIM1_CH1/I2C3_SCL/OTG_FS_SOF)
DCMI_D0: J2.P19(19_D0) U$5.96(PC6/I2S2_MCK/TIM8_CH1/SDIO_D6/USART6_TX/DCMI_D0)
DCMI_D1: J2.P21(21_D1) U$5.97(PC7/I2S3_MCK/TIM8_CH2/SDIO_D7/USART6_RX/DCMI_D1)
DCMI_D2: J2.P22(22_D2) U$5.125(PG10/LCD_G3/FMC_NCE4_1/FMC_NE3/DCMI_D2/LCD_B2)
DCMI_D3: J2.P20(20_D3) U$5.126(PG11/ETH_MII_TX_EN/ETH_RMII_TX_ENFMC_NCE4_2/DCMI_D3)
DCMI_D4: J2.P18(18_D4) U$5.3(PE4/TRACED1/FSMC_A20/DCMI_D4/SPI4_NSS)
DCMI_D5: J2.P16(16_D5) U$5.136(PB6/TIM4_CH1/I2C1_SCL/USART1_TX/CAN2_TX/FMC_SDNE1/DCMI_D5)
DCMI_D6: J2.P14(14_D6) U$5.4(PE5/TRACED2/FSMC_A21/TIM9_CH1/DCMI_D6/SPI4_MISO)
DCMI_D7: J2.P12(12_D7) U$5.5(PE6/TRACED3/FSMC_A22/TIM9_CH2/DCMI_D7/SPI4_MOSI)
DCMI_HSYNC: J2.P9(9_HREF) U$5.40(PA4/SPI1_NSS/SPI3_NSS/USART2_CK/DCMI_HSYNC)
DCMI_I2C1_SCL: J2.P5(5_SIO_C) R40.P$2 U$5.139(PB8/TIM4_CH3/TIM10_CH1/I2C1_SCL/CAN1_RX/SDIO_D4/DCMI_D6)
DCMI_I2C1_SDA: J2.P3(3_SOI_D) R36.P$2 U$5.140(PB9/TIM11_CH1/I2C1_SDA/SPI2_NSS/I2S2_WS/SDIO_D5/DCMI_D7)
DCMI_PCLK: R41.P$2 U$5.42(PA6/SPI1_MISO/TIM8_BKIN/TIM13_CH1/DCMI_PIXCLK)
DCMI_PCLKR: J2.P17(17_PCLK) R41.P$1
DCMI_PWDN: J2.P8(8_PWDN) U$5.123(PD7/USART2_CK/FSMC_NE1/FSMC_NCE2)
DCMI_RST: J2.P6(6_RESET) U$5.102(PA10/TIM1_CH3/USART1_RX/OTG_FS_ID/DCMI_D1)
DCMI_VSYNC: J2.P7(7_VSYNC) U$5.137(PB7/TIM4_CH2//I2C1_SDA/USART1_RX//FMC_NL/DCMI_VSYNC)
DISABLE_PWR: IC2.3(EN) R59.2 TP17.P$1
DRAM_A0: U12.P$23(23_A0) U$5.10(PF0/I2C2_SDA/FMC_A0)
DRAM_A1: U12.P$24(24_A1) U$5.11(PF1/I2C2_SCL/FMC_A1)
DRAM_A2: U12.P$25(25_A2) U$5.12(PF2/I2C2_SMBA/FSMC_A2)
DRAM_A3: U12.P$26(26_A3) U$5.13(PF3/FMC_A3)
DRAM_A4: U12.P$29(29_A4) U$5.14(PF4/FMC_A4)
DRAM_A5: U12.P$30(30_A5) U$5.15(PF5/FMC_A5)
DRAM_A6: U12.P$31(31_A6) U$5.50(PF12/FMC_A6)
DRAM_A7: U12.P$32(32_A7) U$5.53(PF13/FMC_A7)
DRAM_A8: U12.P$33(33_A8) U$5.54(PF14/FMC_A8)
DRAM_A9: U12.P$34(34_A9) U$5.55(PF15/FMC_A9)
DRAM_A10: U12.P$22(22_A10) U$5.56(PG0/FMC_A10)
DRAM_A11: U12.P$35(35_A11) U$5.57(PG1/FMC_A11)
DRAM_A12: U12.P$36(36_A12) U$5.87(PG2/FMC_A12)
DRAM_BA0: U12.P$20(20_BA0) U$5.89(PG4/FMC_A14/FMC_BA0)
DRAM_BA1: U12.P$21(21_BA1) U$5.90(PG5/FMC_A15/FMC_BA1)
DRAM_CAS: U12.P$17(17_CAS) U$5.132(PG15/USART6_CTS/DCMI_D13/FMC_SDNCAS)
DRAM_CLK: U12.P$38(38_CLK) U$5.93(PG8/SPI6_NSS/USART6_RTS/ETH_PPS_OUT/FMC_SDCLK)
DRAM_CLKE: U12.P$37(37_CKE) U$5.45(PC5/ETH_RMII_RX_D1/ETH_MII_RX_D1/ADC12_IN15)
DRAM_CS: U12.P$19(19_CS) U$5.44(PC4/ETH_RMII_RX_D0/ETH_MII_RX_D0/ADC12_IN14)
DRAM_D0: U12.P$2(2_D0) U$5.85(PD14/FMC_D0/TIM4_CH3)
DRAM_D1: U12.P$4(4_D1) U$5.86(PD15/FMC_D1/TIM4_CH4)
DRAM_D2: U12.P$5(5_D2) U$5.114(PD0/FMC_D2/CAN1_RX)
DRAM_D3: U12.P$7(7_D3) U$5.115(PD1/FMC_D3/CAN1_TX)
DRAM_D4: U12.P$8(8_D4) U$5.58(PE7/FMC_D4/TIM1_ETR/UART7_RX)
DRAM_D5: U12.P$10(10_D5) U$5.59(PE8/FSMC_D5/TIM1_CH1N/UART7_TX)
DRAM_D6: U12.P$11(11_D6) U$5.60(PE9/FMC_D6/TIM1_CH1)
DRAM_D7: U12.P$13(13_D7) U$5.63(PE10/FMC_D7/TIM1_CH2N)
DRAM_D8: U12.P$42(42_D8) U$5.64(PE11/FMC_D8/TIM1_CH2/SPI4_NSS)
DRAM_D9: U12.P$44(44_D9) U$5.65(PE12/FMC_D9/TIM1_CH3N/SPI4_SCK)
DRAM_D10: U12.P$45(45_D10) U$5.66(PE13/FMC_D10/TIM1_CH3/SPI4_MISO)
DRAM_D11: U12.P$47(47_D11) U$5.67(PE14/FMC_D11/TIM1_CH4/SPI4_MOSI)
DRAM_D12: U12.P$48(48_D12) U$5.68(PE15/FMC_D12/TIM1_BKIN/)
DRAM_D13: U12.P$50(50_D13) U$5.77(PD8/FMC_D13/USART3_TX)
DRAM_D14: U12.P$51(51_D14) U$5.78(PD9/FMC_D14/USART3_RX)
DRAM_D15: U12.P$53(53_D15) U$5.79(PD10/FMC_D15/USART3_CK)
DRAM_DQMH: U12.P$39(39_DMH) U$5.142(PE1/UART8_TX/FMC_NBL1/DCMI_D3)
DRAM_DQML: U12.P$15(15_DML) U$5.141(PE0/TIM4_ETR/UART8_RX/FMC_NBL0/DCMI_D2)
DRAM_RAS: U12.P$18(18_RAS) U$5.49(PF11/DCMI_12/SPI5_MOSI/FMC_SDNRAS)
DRAM_WE: U12.P$16(16_WE) U$5.43(PA7/SPI1_MOSI/TIM8_CH1N/TIM14_CH1/TIM3_CH2/ETH_MII_RX_DV/ETH_RMII_CRS_DV)
DVDD_REF: C92.2 J2.P10(10_DVDD)
FLIR_1V2: C43.1 C70.1 IC7.5(OUT) IR1.P$7(7_VDDC)
FLIR_2V8: C67.1 C68.1 IC10.5(OUT) IR1.P$19(19_VDD)
FLIR_3V1: C46.1 C69.1 IC8.5(OUT) IR1.P$16(16_VDDIO) R67.P$1 R68.P$1
FLIR_PWRC: IC7.3(EN) IC8.3(EN) IC10.3(EN) U$5.7(PC13/TAMP_1)
FLIR_PWRDN: IR1.P$23(23_PWRDN) U$5.88(PG3/FMC_A13)
FLIR_RESET: IR1.P$24(24_RESET) U$5.124(PG9/USART6_RX/FMC_NE2/FMC_NCE3/DCMI_VSYNC)
FLIR_SENSOR_SCL: IR1.P$21(21_SCL) J6.P1 R58.2 R67.P$2 R70.2 U6.P$6(6_SCK) U20.P$1(1_SCLK) U$5.69(PB10/SPI2_SCK/I2S2_CK/I2C2_SCL/USART3_TX/OTG_HS_ULPI_D3/TIM2_CH3)
FLIR_SENSOR_SDA: IR1.P$22(22_SDA) J6.P3 R57.2 R68.P$2 R87.2 U6.P$1(1_SDA) U20.P$7(7_SDA) U$5.70(PB11/I2C2_SDA/USART3_RX/OTG_HS_ULPI_D4/ETH_RMII_TX_EN/TIM2_CH4)
FRM_GPS: TP10.P$1 U15.P$2(2_TXD) U24.P$13(13_PB3)
FS_DM: C29.1 D3.P$2(2_S2) R55.2 U$5.103(PA11/TIM1_CH4/USART1_CTS/CAN1_RX/LCD_R4/OTG_FS_DM)
FS_DP: C30.1 D3.P$3(3_S1) R54.2 U$5.104(PA12/TIM1_ETR/USART1_RTS/CAN1_TX/LCD_R5/OTG_FS_DP)
FS_LOWPWR: TP43.P$1 U8.A5(A5_LOWPWR) U24.P$2(2_PA3_TCLK)
FS_RST: TP41.P$1 U8.A1(A1_RST) U24.P$8(8_PA7)
FS_SCL: R46.1 R70.1 TP42.P$1 U24.P$24(24_PA1)
FS_SDA: R85.1 R87.1 TP9.P$1 U24.P$1(1_PA2)
GND: B2.NEG BATT1.1NA BATT1.1NB BATT1.1NC BATT1.2NA BATT1.2NB BATT1.2NC BATT1.3NA BATT1.3NB BATT1.3NC BATT1.4NA BATT1.4NB BATT1.4NC BATT1.5NA BATT1.5NB BATT1.5NC BATT1.6NA BATT1.6NB BATT1.6NC C1.2 C2.2 C3.2 C4.2 C5.2 C6.2 C7.2 C8.2 C9.2 C10.2 C11.2(2N) C12.2 C13.2 C14.2 C15.2 C20.2 C25.2 C26.2(2N) C27.2 C28.1 C29.2 C30.2 C33.2 C34.2 C35.2 C36.2 C37.2 C38.2 C39.2 C40.2 C41.2 C42.2 C43.2 C44.2 C45.2 C46.2 C47.P$1 C48.P$2 C49.P$2 C50.2 C51.2 C52.2 C53.2 C54.2 C55.2 C56.2 C57.2 C58.2 C59.C(-) C60.2 C61.2 C62.2 C63.2 C64.2 C65.2 C66.2(2N) C67.2 C68.2 C69.2 C70.2 C71.1 C75.2 C76.1 C86.2(2N) C87.2 C88.2 C89.2 C92.1 C102.2N C155.P$2 D2.1_A(A) D2.2_A D3.P$1(1_GND) F2.2 G1.P$1(1_GND) G1.P$2(2_GND) G2.P$1(1_GND) G2.P$2(2_GND) IC1.2(GND) IC2.2(GND) IC3.2(GND) IC5.2(GND) IC6.2(GND) IC7.2(GND) IC8.2(GND) IC10.2(GND) IR1.P$1(1_GND) IR1.P$6(6_GND) IR1.P$8(8_GND) IR1.P$9(9_GND) IR1.P$10(10_GND) IR1.P$15(15_GND) IR1.P$18(18_GND) IR1.P$20(20_GND) IR1.P$25(25_GND) IR1.P$27(27_GND) IR1.P$30(30_GND) IR1.P$33(33_SHIELD) IR1.P$34(34_SHIELD) IR1.P$35(35_SHIELD) IR1.P$36(36_SHIELD) IR1.P$37(37_SHIELD) IR1.P$38(38_SHIELD) IR1.P$39(39_SHIELD) IR1.P$40(40_SHIELD) IR1.P$41(41_SHIELD) IR1.P$42(42_SHIELD) IR1.P$43(43_SHIELD) IR1.P$44(44_SHIELD) IR1.P$45(45_SHIELD) IR1.P$46(46_SHIELD) IR1.P$47(47_SHIELD) IR1.P$48(48_SHIELD) IR1.P$49(49_SHIELD) IR1.P$50(50_SHIELD) IR1.P$51(51_SHIELD) IR1.P$52(52_SHIELD) IR1.P$53(53_SHIELD) IR1.P$54(54_SHIELD) IR1.P$55(55_SHIELD) IR1.P$56(56_SHIELD) IR1.P$57(57_SHIELD) IR1.P$58(58_SHIELD) IR1.P$59(59_SHIELD) IR1.P$60(60_SHIELD) IR1.P$61(61_SHIELD) IR1.P$62(62_SHIELD) IR1.P$63(63_SHIELD) IR1.P$64(64_SHIELD) IR1.P$65(65_SHIELD) IR1.P$66(66_SHIELD) IR1.P$67(67_SHIELD) IR1.P$68(68_SHIELD) J2.P15(15_DGND) J2.P$25 J2.P$26 J2.P$27 J2.P$28 J3.4_GND J3.P$1(5_S) J3.P$2(6_S) J4.5_GND J5.5__GND(5_GND) J6.P4 J7.P$2(2B) J8.5_GND J9.P$2(P2_SHLD) LCD1.2_VSS LED17.C PIR2.VSS Q3.5(N_S) Q8.5(N_S) R1.P$2 R2.P$2 R5.1 R6.P$2 R11.1 R12.P$2 R17.1 R18.P$2 R23.1 R27.P$2 R29.1 R32.1 R34.1 R47.P$2 R48.P$2 R49.P$2 R50.P$2 R51.P$2 R52.P$2 R53.P$2 R81.1 R89.P$2 R94.1 R95.1 SD1.P3(P3_VSS) SD1.P6(P6_VSS) SD1.P$12(GND_A) SD1.P$13(GND_B) SW1.P$1 SW2.P$4(GND_A) SW2.P$5(GND_B) SW3.2_SW(NO) SW3.3_SHIELD(GND_A) T2.P$1 T3.P$1 T12.P$1 TP1.P$1 TP3.P$1 TP13.P$1 TP16.P$1 TP24.P$1 U1.P$5(5_GND) U2.P$5(5_GND) U3.P$5(5_GND) U4.P$5(5_GND) U5.P$5(5_GND) U6.P$2(2_GND) U7.2(2_VSS) U8.A2(A2_RSVD_GND) U8.A6(A6_RSVD_GND) U8.A7(A7_RSVD_GND) U8.B2(B2_GND) U8.B3(B3_GND) U8.B4(B4_GND) U8.C1(C1_GND) U8.C5(C5_RSVD_GND) U8.C6(C6_RSVD_GND) U8.C7(C7_GND) U10.P$5(5_GND) U11.4(4_GND) U11.8(8_GND) U12.P$6(6_VSS) U12.P$12(12_VSS) U12.P$28(28_VSS) U12.P$41(41_VSS) U12.P$46(46_VSS) U12.P$52(52_VSS) U12.P$54(54_VSS) U13.P$3(3_GND) U15.P$1(1_GND) U15.P$10(10_GND) U15.P$12(12_GND) U17.4_GND U18.P$2(2_GND) U19.2(2_GND) U20.P$2(2_GND) U20.P$3(3_CSB) U24.P$3(3_GND) U24.P$25(25_GND) U$1.P$6(6_VSS) U$1.P$12(12_K) U$5.16(VSS) U$5.31(VSSA) U$5.38(VSS) U$5.51(VSS) U$5.61(VSS) U$5.83(VSS) U$5.94(VSS) U$5.107(VSS) U$5.120(VSS) U$5.130(VSS) X2.P$1(1_GND) X2.P$4(4_GND)
GPS1: G2.P$3(3_PIN) L5.P$2 U15.P$11(11_RF_IN)
GPS_RESET: U15.P$9(9_RESET) U24.P$5(5_PA4)
GPS_VCC_X: C44.1 C45.1 C47.P$2 IC3.5(OUT) L5.P$1 U15.P$7(7_VCC_IO) U15.P$8(8_VCC)
GPSPWRC: IC3.3(EN) U24.P$22(22_PC5)
LCD_CSB: U$1.P$3(3_CSB) U$5.41(PA5/SPI1_SCK/OTG_HS_ULPI_CK/TIM2_CH1/TIM2_ETR/TIM8_CHIN/ADC12_IN5)
LCD_PWRC: Q2.1_G(G) U$5.128(PG13/SPI6_SCK/USART6_CTS/ETH_MII_TXD0/ETH_RMII_TXD0/FMC_A24)
LCD_RS: U$1.P$2(2_RS) U$5.2(PE3/TRACED0/FSMC_A19)
LCD_RST: U$1.P$1(1_RST) U$5.129(PG14/SPI6_MOSI/USART6_TX/ETH_MII_TXD1/ETH_RMII_TXD1/FMC_A25)
LCD_SCL: TP21.P$1 U$1.P$4(4_SCL) U$5.80(PD11/FMC_A16/USART3_CTS)
LCD_SI: U$1.P$5(5_SI) U$5.34(PA0/USART2_CTS/UART4_TX/TIM2_CH1_ETR/WKUP/TIM5_CH1/TIM8_ETR)
LED_BLUE: LED18.2_K(C) U$5.27(PC1/ETH_MDC/ADC123_IN11)
LED_IR: R37.2 TP46.P$1 U$5.1(PE2/TRACECLK/FSMC_A23/ETH_MII_TXD3/SPI4_SCK)
LED_RED: LED11.C U$5.26(PC0/OTG_HS_ULPI_STP/ADC123_IN10/FMC_SDNWE)
LRW_PWRC: M2.16(P0_02-AIN0) U18.P$3(3_ON_OFF) U$5.29(PC3/SPI2_MOSI/I2S2_SD/OTG_HS_ULPI_NXT/ETH_MII_TX_CLK/FMC_SDCKE0)
N$1: R53.P$1 U11.5(5_SYNC)
N$2: BATT1.6PA BATT1.6PB BATT1.6PC C17.1 D12.2_A(A) U2.P$9(9_BAT)
N$3: C15.1 U10.P$4(4_TIMER)
N$4: R2.P$1 U10.P$7(7_PROG)
N$5: LED1.A R8.P$2
N$6: Q3.4(P_D) SW2.P$2(C) TP7.P$1
N$7: BATT1.4PA BATT1.4PB BATT1.4PC C19.1 D10.2_A(A) U3.P$9(9_BAT)
N$8: Q3.1(N_G) R26.P$2 U7.1(1_OUT)
N$9: Q1.1_G(G) R37.1 R94.2 R96.2
N$10: C24.1 U11.3(3_CB)
N$11: LED18.1_A(A) R35.1
N$12: Q3.3(P_G) Q3.6(N_D) R25.P$2
N$13: BATT1.1PA BATT1.1PB BATT1.1PC C23.1 D8.2_A(A) U10.P$9(9_BAT)
N$14: BATT1.2PA BATT1.2PB BATT1.2PC C18.1 D7.2_A(A) U1.P$9(9_BAT)
N$16: BATT1.5PA BATT1.5PB BATT1.5PC C21.1 D11.2_A(A) U4.P$9(9_BAT)
N$17: J9.P$3(P3_ALT) TP5.P$1
N$18: C2.1 U1.P$4(4_TIMER)
N$19: LED4.A R14.P$2
N$20: R1.P$1 U1.P$7(7_PROG)
N$21: LED2.A R3.P$2
N$22: LED4.C U10.P$1(1_CHRG)
N$23: LED2.C U1.P$1(1_CHRG)
N$24: LED8.C U1.P$3(3_FAULT)
N$25: R4.P$2 R5.2 U1.P$6(6_NTC)
N$26: LED11.A R43.1
N$27: LED1.C U10.P$3(3_FAULT)
N$28: C4.1 U3.P$4(4_TIMER)
N$29: R6.P$1 U3.P$7(7_PROG)
N$30: LED3.A R7.P$2
N$31: R20.P$2 R29.2 U10.P$6(6_NTC)
N$32: LED5.A R9.P$2
N$33: C17.2 R47.P$1
N$34: LED5.C U3.P$1(1_CHRG)
N$35: LED3.C U3.P$3(3_FAULT)
N$36: R10.P$2 R11.2 U3.P$6(6_NTC)
N$37: LED7.C U24.P$19(19_PC2)
N$38: C10.1 U2.P$4(4_TIMER)
N$39: C6.1 U4.P$4(4_TIMER)
N$40: R12.P$1 U4.P$7(7_PROG)
N$41: LED6.A R13.P$2
N$42: LED16.K(C) LED19.A
N$43: LED9.A R15.P$2
N$44: LED7.A R42.P$2
N$45: LED9.C U4.P$1(1_CHRG)
N$46: LED6.C U4.P$3(3_FAULT)
N$47: R16.P$2 R17.2 U4.P$6(6_NTC)
N$48: C35.1 R34.2 R60.1 U24.P$7(7_PA6)
N$49: R27.P$1 U2.P$7(7_PROG)
N$50: LED13.A R28.P$2
N$51: C8.1 U5.P$4(4_TIMER)
N$52: R18.P$1 U5.P$7(7_PROG)
N$53: LED10.A R19.P$2
N$54: C18.2 R48.P$1
N$55: LED12.A R21.P$2
N$56: C19.2 R49.P$1
N$57: LED12.C U5.P$1(1_CHRG)
N$58: LED10.C U5.P$3(3_FAULT)
N$59: R22.P$2 R23.2 U5.P$6(6_NTC)
N$60: C32.1 IC4.3(EN) R56.1
N$61: LED15.A R30.P$2
N$63: LED15.C U2.P$1(1_CHRG)
N$64: LED13.C U2.P$3(3_FAULT)
N$65: R31.P$2 R32.2 U2.P$6(6_NTC)
N$66: C21.2 R50.P$1
N$67: BATT1.3PA BATT1.3PB BATT1.3PC C22.1 D9.2_A(A) U5.P$9(9_BAT)
N$68: LED19.K(C) R95.2
N$70: B2.PLUS U$5.6(VBAT)
N$71: R61.2 R62.2 R63.2 R64.2 R66.2 R73.1 SD1.P4(P4_VCC)
N$72: C13.1 C71.2 Q2.3_D(D) U$1.P$7(7_VDD) U$1.P$11(11_A)
N$73: J3.2_DM R55.1
N$74: R39.P$2 R46.2 U8.C4(C4_SCL)
N$75: C16.1 U$1.P$10(10_C1-)
N$76: C16.2 U$1.P$9(9_C1+)
N$77: LED8.A R65.P$2
N$78: J3.3_DP R54.1
N$79: D4.K U15.P$6(6_VBCKP)
N$80: R38.P$2 R85.2 U8.C3(C3_SDA)
N$81: C42.1 U$1.P$8(8_VOUT)
N$84: C22.2 R51.P$1
N$85: R71.1 U24.P$4(4_VDD)
N$86: F1.1 IC1.1(IN) R72.2
N$87: C38.1 C39.1 IC6.5(OUT) R73.2
N$88: C40.1 IC5.5(OUT) R74.2
N$90: R79.1 R80.2 U19.4(4_VH)
N$91: C88.1 IC2.5(OUT) R69.2
N$92: C23.2 R52.P$1
N$93: C24.2 D2.3_K(K) I1.P$4 U11.1(1_VSW)
N$95: C25.1 J9.P$1(P1_CTR) TP14.P$1 U11.2(2_VIN)
N$98: LED14.1_A(A) R86.1
N$101: F1.2 IC4.1(IN)
N$102: PIR2.SI(SERIAL_IN) U24.P$9(9_PB7)
N$104: C48.P$1 U$5.24(PH1/OSC_OUT) X1.P$1(1_XTAL)
N$105: C49.P$1 U$5.23(PH0/OSC_IN) X1.P$3(3_XTAL)
N$106: C56.1 C60.1 U16.1 U$5.32(VREF+) U$5.33(VDDA)
N$108: M2.34(BLE_ANT) M2.35(BLE_TR)
N$109: J8.3_RST M2.40(P0_21_RESET)
N$110: R80.1 R81.2 U19.3(3_VL)
N$111: J8.2_DIO M2.38(SWD_IO)
N$112: Q8.1(N_G) U19.6(6_BATTLO)
N$113: J8.4_CLK M2.37(SWD_CLK)
N$114: Q8.3(P_G) Q8.6(N_D) R82.1
N$115: R90.2 R91.P$2 U18.P$5(5_VOUT)
N$116: M2.18(P0_30_AIN6) R92.P$1 TP31.P$1
N$117: M2.9(P0_13)
N$118: M2.6(P0_22)
N$119: M2.12(P0_04-AIN2)
N$120: G1.P$3(3_PIN) M2.24(LORA_TR)
N$121: LED17.A R92.P$2
N$122: C62.1 C63.1 C64.1 J8.1_VREF M2.15(VDD) R90.1
N$123: J8.6_SWO TP22.P$1
N$134: C65.1 LED16.A Q1.3_D(D)
N$173: PIR2.DL(DIRECT_LINK) U24.P$10(10_PB6)
NRST: C61.1 J4.3_RST R88.P$2 SW1.P$2 U$5.25(NRST)
OSC32_IN: U$5.8(PC14/OSC32_IN) X2.P$2(2_OUT)
OSC32_OUT: U$5.9(PC15/OSC32_OUT)
PI_PWRC: M2.20(P0_28_AIN4)
QSPI_CLK: U17.6_CL(6_CLK) U$5.22(PF10/FMC_INTR/DCMI_D11/LCD_DE)
QSPI_CS: U17.1_CS U$5.91(PG6/FSMC_INT2/DCMI_D12)
QSPI_D0: U17.5_DI(5_MOSI) U$5.20(PF8/TIM13_CH1/SPI5_MISO/SAI1_SCK_B/FMC_NIOWR)
QSPI_D1: U17.2_DP(2_MISO) U$5.21(PF9/TIM14_CH1/SPI5_MOSI/SAI1_FS_B/FMC_CD)
QSPI_D2: U17.3_WP U$5.19(PF7/TIM11_CH1/SPI5_SCK/SAI1_MCLK_B/UART7_TX/FMC_NREG)
QSPI_D3: U17.7_RST U$5.18(PF6/TIM10_CH1/SPI5_NSS/SAI1_SD_B/UART7_RX/FMC_NIORD)
RST_TINY: J5.2_RST_PGM(2_RESET) U24.P$23(23_PA0_RST) U$5.35(PA1/USART2_RTS/UART4_RX/TIM5_CH2/TIM2_CH2)
RX_FRM_LRW: M2.10(P0_06) TP32.P$1 U$5.122(PD6/SPI3_MOSI/I2S3_SD/USART2_RX/FMC_NWAIT/DCMI_D10)
SD_CD: SD1.CD TP23.P$1 U$5.92(PG7/FSMC_INT3/DCMI_D13)
SDIO_CLK: SD1.P5(P5_CLK) U$5.113(PC12/UART5_TX/SDIO_CK/DCMI_D9/SPI3_MOSI/I2S3_SD/USART3_CK)
SDIO_CMD: R66.1 SD1.P2(P2_CMD) U$5.116(PD2/TIM3_ETR/UART5_RX/SDIO_CMD/DCMI_D11)
SDIO_D0: R64.1 SD1.P7(P7_DAT0) U$5.98(PC8/TIM8_CH3/SDIO_D0/TIM3_CH3/USART6_CK/DCMI_D2)
SDIO_D1: R63.1 SD1.P8(P8_DAT1) U$5.99(PC9/I2S_CKIN/MCO2/TIM8_CH4/SDIO_D1/I2C3_SDA/DCMI_D3/TIM3_CH4)
SDIO_D2: R61.1 SD1.P9(P9_DAT2) U$5.111(PC10/SPI3_SCK/I2S3_CK/UART4_TX/SDIO_D2/DCMI_D8/USART3_TX)
SDIO_D3: R62.1 SD1.P1(P1_DAT3) U$5.112(PC11/UART4_RX/SPI3_MISO/SDIO_D3/DCMI_D4)
SDIO_PWRC: IC6.3(EN) R84.1
SENS_PWR: C33.1 C34.1 C41.1 J6.P2 Q5.3_D(D) R57.1 R58.1 U6.P$5(5_VCC) U20.P$5(5_VDD) U20.P$6(6_PS)
SENSOR_PWRC: Q5.1_G(G)
SENSPWR: R75.1 R76.1 R77.1 U13.P$2(2_VDD)
SPI2_MISO: IR1.P$12(12_MISO) U$5.75(PB14/SPI2_MISO/TIM1_CH2N/TIM12_CH1/OTG_HS_DM/USART3_RTS/TIM8_CH2N)
SPI2_MOSI: IR1.P$11(11_MOSI) U$5.76(PB15/SPI2_MOSI/I2S2_SD/TIM1_CH3N/TIM8_CH3N/TIM12_CH2/OTG_HS_DP)
SPI2_NSS: IR1.P$14(14_CSL) U$5.73(PB12/SPI2_NSS/I2S2_WS/I2C2_SMBA/USART3_CK/TIM1_BKIN/CAN2_RX)
SPI2_SCLK: IR1.P$13(13_CLK) U$5.74(PB13/SPI2_SCK/I2S2_CK/USART3_CTS/TIM1_CH1N/CAN2_TX/OTG_HS_ULPI_D6)
SPI3_MISO: U$5.134(PB4/NJTRST/TIM3_CH1/SPI1_MISO/SPI3_MISO/I2S3EXT_SD)
SPI3_MOSI: U$5.135(PB5/TIM3_CH2/SPI1_MOSI/SPI3_MOSI/I2S3_SD/DCMI_D10/FMC_SDCKE1)
SPI3_SCLK/TRACESWO: J4.6_SWO U$5.133(PB3/JTDO/TRACESWO/SPI3_SCK/I2S3_CK/TIM2_CH2/SPI1_SCK)
SPI3_SSEL: U$5.110(PA15/JTDI/SPI3_NSS/I2S3_WS/TIM2_CH1_ETR/SPI1_NSS)
SRAM_PWRC: IC5.3(EN) R33.1 U$5.47(PB1/TIM3_CH4/TIM8_CH3N/TIM1_CH3N/OTG_HS_ULPI_D2/ETH_MII_RXD3)
SRAMPWR: C12.1 C20.1 C27.1 R74.1 U12.P$1(1_VDD) U12.P$3(3_VDD) U12.P$9(9_VDD) U12.P$14(14_VDD) U12.P$27(27_VDD) U12.P$43(43_VDD) U12.P$49(49_VDD)
SUPPLY: C11.1(1P) C66.1(1P) C87.1 D6.1_K(K) IC2.1(IN) IC3.1(IN) IC5.1(IN) IC6.1(IN) IC7.1(IN) IC8.1(IN) IC10.1(IN) J7.P$1(1A) Q1.2_S(S) R33.2 R59.1 R60.2 R72.1 R78.2 R83.1 R84.2 R91.P$1 R96.1 SW2.P$1(NO) T13.P$1 TP6.P$1 U18.P$1(1_VIN)
SWCLK: J4.4_CLK U$5.109(PA14/JTCK-SWCLK)
SWDIO: J4.2_DIO U$5.105(PA13/JTMS-SWDIO)
T_SCL: R77.2 TP11.P$1 U13.P$1(1_SCL) U24.P$11(11_PB5)
T_SDA: R76.2 TP15.P$1 U13.P$4(4_SDA) U24.P$12(12_PB4)
TO_GPS: LCD1.1_D T6.P$1 U15.P$3(3_RXD) U24.P$14(14_PB2)
TP_AVAILABLE_0: T5.P$1 U$5.118(PD4/USART2_RTS/FMC_NOE)
TP_AVAILABLE_1: TP8.P$1 U$5.81(PD12/FMC_A17/TIM4_CH1/USART3_RTS)
TP_AVAILABLE_2: T4.P$1 U$5.82(PD13/FMC_A18/TIM4_CH2)
TX_TO_LRW: M2.8(P0_08) T1.P$1 U$5.119(PD5/USART2_TX/FMC_NWE)
USB5V: C155.P$1 D3.P$4(4_PWR) D6.2_A(A) J3.1_VBUS(1_5V) LCD1.3_VDD TP19.P$1 U$5.101(PA9/TIM1_CH2/I2C3_SMBA/USART1_TX/DCMI_D0/OTG_FS_VBUS) ; supply symbol labelled VBUS
USER_LED: U24.P$15(15_PB1)
USER_LED_GRN: LED14.2_K(C) TP18.P$1 U$5.28(PC2/SPI2_MISO/I2S2EXT_SD/OTG_HS_ULPI_DIR/ETH_MII_TXD2/FMC_SDNE0)
USER_PBUTTON: SW3.1_SW(C) U24.P$6(6_PA5)
VCAP1: C51.1 U$5.106(VCAP)
VCAP2: C50.1 U$5.71(VCAP)
VCC: C28.2 C36.1 C37.1 C52.1 C53.1 C54.1 C55.1 C57.1 C58.1 C59.A(+) C86.1(1P) D4.A J4.1_VREF J5.1_VCC(1_PWR) PIR2.VDD Q2.2_S(S) Q5.2_S(S) R35.2 R38.P$1 R39.P$1 R42.P$1 R43.2 R44.P$1 R45.P$1 R69.1 R71.2 R75.2 R86.2 R88.P$1 T8.P$1 TP12.P$1 U8.A4(A4_VDDIO) U8.B1(B1_VDDA) U8.B7(B7_VDDA) U16.2 U17.8_VCC U$5.17(VDD) U$5.30(VDD) U$5.39(VDD) U$5.52(VDD) U$5.62(VDD) U$5.72(VDD) U$5.84(VDD) U$5.95(VDD33USB) U$5.108(VDD) U$5.121(VDD) U$5.131(VDD) U$5.143(PDR_ON) U$5.144(VDD) X2.P$3(3_VCC)
VCC1: D5.K Q8.2(P_S) R78.1 R82.2
VCC9: Q8.4(P_D) R83.2
WU_BIG: TP20.P$1 U24.P$17(17_PC0) U$5.36(PA2/USART2_TX/TIM5_CH3/TIM9_CH1/TIM2_CH3/ETH_MDIO)
WU_TINY: TP26.P$1 U24.P$18(18_PC1) U$5.37(PA3/USART2_RX/TIM5_CH4/TIM9_CH2/TIM2_CH4/OTG_HS_ULPI_D0)
Unconnected: IC1.4(BYP) IC2.4(BYP) IC3.4(BYP) IC4.4(BYP) IC5.4(BYP) IC6.4(BYP) IC7.4(BYP) IC8.4(BYP) IC10.4(BYP) IR1.P$2(2_GPIO3) IR1.P$3(3_GPIO2) IR1.P$4(4_GPIO1) IR1.P$5(5_GPIO0) IR1.P$17(17_NC) IR1.P$28(28_RESERVED) IR1.P$29(29_RESERVED) IR1.P$31(31_RESERVED) IR1.P$32(32_RESERVED) J2.P1(1_NC) J2.P23(23_NC) J2.P24(24_NC) J5.3__NC(3_NC) J5.4__NC(4_NC) J5.6__NC(6_ND) J7.P$3(3_NC) J7.P$4(4_CN) LCD1.P$1 LCD1.P$2 LCD1.P$3 LCD1.P$4 M2.2(P0_12) M2.3(P0_10_NFC2) M2.4(P0_17) M2.5(P0_07) M2.7(P0_09_NFC1) M2.11(P0_05-AIN3) M2.13(P0_03-AIN1) M2.17(P0_31_AIN7) M2.19(P0_29_AIN5) M2.39(P0_20_TRCCLK) M2.41(P0_18_TRCDAT0) M2.42(P0_16_TRCDAT1) M2.43(P0_15_TRCDAT2) M2.44(P0_14_TRCDAT3) M2.45(NC) M2.46(NC) M2.47(NC) M2.48(NC) M2.49(NC) M2.50(NC) M2.51(NC) M2.52(NC) M2.53(NC) M2.54(NC) M2.55(NC) M2.56(NC) M2.57(NC) M2.58(NC) M2.59(NC) M2.60(NC) M2.61(NC) M2.62(NC) M2.63(NC) M2.64(NC) M2.65(NC) M2.66(NC) M2.67(NC) M2.68(NC) M2.69(NC) M2.70(NC) M2.71(NC) M2.72(NC) M2.73(NC) SD1.WP SW2.P$3(NC) U1.P$10(10_ACPR) U1.P$11(11_GND) U2.P$10(10_ACPR) U2.P$11(11_GND) U3.P$10(10_ACPR) U3.P$11(11_GND) U4.P$10(10_ACPR) U4.P$11(11_GND) U5.P$10(10_ACPR) U5.P$11(11_GND) U6.P$3(3_NC) U6.P$4(4_NC) U6.P$7(7_GND) U8.A3(A3_INT) U8.C2(C2_IO) U10.P$10(10_ACPR) U10.P$11(11_GND) U11.7(7_ON) U12.P$40(40_NC) U15.P$4(4_PULSE) U15.P$5(5_EXTIN0) U15.P$13(13_ANT_ON) U15.P$14(14_VCC_RF) U15.P$15(15_V_ANT) U15.P$16(16_SDA) U15.P$17(17_SCL) U15.P$18(18_NC) U17.P$9(9_GND) U18.P$4(4_NC) U20.P$4(4_NC) U20.P$8(8_SDO) U24.P$21(21_PC4) X1.P$2(2_NC) X1.P$4(4_NC)

## Notes on the sheet
- SDcards have absolute max 3.6v
- Tie GPS Reset high?
- 3.6v
- Host can connect ID pin to gnd
- Device can unconnect or connect to ID on uP
- OTG connected to ID on uP.
- gets hot at 4.5ohm
- ATWINC: 310mA
- ImageSensor: 60mA
- Processor: 30mA | VCC Device Power
- BATT
- For Bootloader from USB
- BATT
- curr
- Delete this batt sense stuff?
- It's not connected to the batteries!
- Boot from intern flash when low
- Internal Pullup OK
- 2.65V 3.65V = 370K 517K 113K
- LBSEL=VCC:LBdisconnect at 3.2v
- LBSEL=GND:LBdisconnect at 2.7v
- Boot1 must be high when doing USB bootloader with Boot0 high.
- This can be 5v when batt board is charging.
- Altimeter
- LCD
- VR provides for strong instant pwr-up when connecting to a dead LiPo
- ADJ to GND sets float to 4.0v
- 1.7-3.0v | ATSAMS7 is 1.7v-3.6v 4.0max
- 2.8v
- 1554HGYCL 2.3"h Clear
- ON/OFF SW
- Needed for unprotected LiPos?
- 1.2K max (for 1.25A chrg curr) | 1.2K max (for 1.25A chrg curr)
- 1.2K max (for 1.25A chrg curr) | 1.2K max (for 1.25A chrg curr) | 1.2K max (for 1.25A chrg curr)
- 1.2K max (for 1.25A chrg curr)

## Power pins joined to a net without a drawn wire
GND: M2.1(GND) M2.14(GND) M2.21(GND) M2.22(GND) M2.23(GND) M2.26(GND) M2.27(GND) M2.28(GND) M2.29(GND) M2.30(GND) M2.31(GND) M2.32(GND) M2.33(GND) M2.36(GND) M2.74(GND) M2.75(GND) M2.76(GND) M2.77(GND) M2.78(GND) M2.79(GND) M2.80(GND) M2.81(GND) M2.82(GND) M2.83(GND) M2.84(GND) M2.85(GND) M2.86(GND) M2.87(GND) M2.88(GND) M2.89(GND) M2.90(GND) M2.91(GND) M2.92(GND) M2.93(GND) M2.94(GND) M2.95(GND) M2.96(GND) M2.97(GND)
LORA_ANT: M2.25(LORA_ANT)

## Library data of the parts
B2 = BBox02:BATT_COIN_BR1225
BATT1 = BBox02:BATT_6X18650
BOX1 = BBox02:ENCL_1554H
C1 C3 C5 C7 C9 C14 C16-C19 C21-C23 C31 C34 C37 C39 C40 C42-C44 C46 C60 C61 C63 C64 C67 C71 C74 C75 C87-C89 = BBox02:CAP_0603
C2 C4 C6 C8 C10 C15 C24 C25 C28 C41 C76 C92 C93 = BBox02:CAP_0402
C11 C66 = BBox01:CAP_1210
C12 C13 C20 C27 C29 C30 C32 C33 C35 C36 C38 C45 C62 C65 C68-C70 = BBox01:CAP_0402
C26 C86 = BBox02:CAP_1210
C47 = HO2:CAP_0402@2
C48 C49 C155 = BBox02:CAP_0402_SM
C50-C58 = sfe:CAP: Capacitor Standard 0603 ceramic capacitor, and 0.1" leaded capacitor.
C59 = sfe:CAP_POL: Capacitor Polarized These are standard SMD and PTH capacitors. Normally 10uF, 47uF, and 100uF in electrolytic and tantalum varieties. Always verify the external diameter of the through hole cap, it varies with capacity, voltage, and manufacturer. The EIA devices should be standard.
C102 = BBox01:CAP0805ELEC
D2 = BBox02:DIODE_BIG
D3 = BBox02:ESD_SM
D4 D5 = HO2:DIO_SCH
D6-D12 = BBox02:DIODE_SCHTKY
F1 F2 = BBox02:FERRITE_0603
G1 G2 = HO2:GPS_ANT
I1 = BBox02:IND_CDRH4
IC1-IC8 IC10 = v-reg-micrel:MIC5219XX: VOLTAGE REGULATOR; OC_FARNELL: unknown; OC_NEWARK: unknown
IR1 = BBox02:FLIR_LEPTOP_SOCKET
J2 = BBox02:CONN_FPC_24P
J3 = BBox02:USB_B_SMT_HORIZ
J4 J8 = BBox02:HDR_SEGER_6P
J5 = BBox02:HDR_PGM_TINY_SMT
J6 = BBox02:CONN_4PCABLE_VERT
J7 = BBox02:CONN_2PCABLE_SMT
J9 = HO3:PWR_JAC4
L5 = HO2:IND_SMD
LCD1 = BBox02:LCD_NHD_3PIN
LED1-LED13 LED15-LED17 LED19 = led:LED: LED OSRAM: - CHIPLED LG R971, LG N971, LY N971, LG Q971, LY Q971, LO R971, LY R971 LH N974, LH R974 LS Q976, LO Q976, LY Q976 LO Q996 - Hyper CHIPLED LW Q18S LB Q993, LB Q99A, LB R99A - SideLED LS A670, LO A670, LY A670, LG A670, LP A670 LB A673, LV A673, LT A673, LW A673 LH A674 LY A675 LS A676, LA A676, LO A676, LY A676, LW A676 LS A679, LY A679, LG A679 - Hyper Micro SIDELED® LS Y876, LA Y876, LO Y876, LY Y876 LT Y87S - SmartLED LW L88C, LW L88S LB L89C, LB L89S, LG L890 LS L89K, LO L89K, LY L89K LS L896, LA L896, LO L896, LY L896 - TOPLED LS T670, LO T670, LY T670, LG T670, LP T670 LSG T670, LSP T670, LSY T670, LOP T670, LYG T670 LG T671, LOG T671, LSG T671 LB T673, LV T673, LT T673, LW T673 LH T674 LS T676, LA T676, LO T676, LY T676, LB T676, LH T676, LSB T676, LW T676 LB T67C, LV T67C, LT T67C, LS T67K, LO T67K, LY T67K, LW E67C LS E67B, LA E67B, LO E67B, LY E67B, LB E67C, LV E67C, LT E67C LW T67C LS T679, LY T679, LG T679 LS T770, LO T770, LY T770, LG T770, LP T770 LB T773, LV T773, LT T773, LW T773 LH T774 LS E675, LA E675, LY E675, LS T675 LS T776, LA T776, LO T776, LY T776, LB T776 LHGB T686 LT T68C, LB T68C - Hyper Mini TOPLED® LB M676 - Mini TOPLED Santana® LG M470 LS M47K, LO M47K, LY M47K Source: http://www.osram.convergy.de LUXEON: - LUMILED® LXK2-PW12-R00, LXK2-PW12-S00, LXK2-PW14-U00, LXK2-PW14-V00 LXK2-PM12-R00, LXK2-PM12-S00, LXK2-PM14-U00 LXK2-PE12-Q00, LXK2-PE12-R00, LXK2-PE12-S00, LXK2-PE14-T00, LXK2-PE14-U00 LXK2-PB12-K00, LXK2-PB12-L00, LXK2-PB12-M00, LXK2-PB14-N00, LXK2-PB14-P00, LXK2-PB14-Q00 LXK2-PR12-L00, LXK2-PR12-M00, LXK2-PR14-Q00, LXK2-PR14-R00 LXK2-PD12-Q00, LXK2-PD12-R00, LXK2-PD12-S00 LXK2-PH12-R00, LXK2-PH12-S00 LXK2-PL12-P00, LXK2-PL12-Q00, LXK2-PL12-R00 Source: www.luxeon.com KINGBRIGHT: KA-3528ASYC Source: www.kingbright.com
LED14 LED18 = BBox02:LED_RA_SM
LM2 = BBox02:LENS_MOUNT_CMT107
M2 = InSight_SiP_ISP4520xx:ISP4520*: ISP4520 Combined BLE and LoRa Module Based on the Nordic nRF52832 Bluetooth Low Energy Chip and Semtech SX126x LoRa Transceiver together with Integrated Antennas, matching networks, crystals, DC/DC power supply, NFC and 512kByte Flash and 64kByte SRAM DATASHEET ISP4520xx <https://www.insightsip.com/fichiers_insightsip/pdf/ble/ISP4520/isp_lora_DS4520.pdf>
PIR2 = BBox02:PIR_DUAL_4P
Q1 Q2 Q5 = BBox02:MOSFET_P
Q3 = BBox02:FET_PAIR
Q8 = BBox01:FET_PAIR
R1 R2 R6 R12 R18 R24 R27 R36 R38-R41 R44 R45 R67 R68 = BBox02:RES_0402
R3 R4 R7-R10 R13-R16 R19-R22 R25 R26 R28 R30 R31 R42 R47-R53 R65 R88 R89 R91 R92 = HO2:RES_0402
R5 R11 R17 R23 R29 R32 R78 = resistor:R-US_: RESISTOR, American symbol
R33-R35 R37 R43 R46 R54-R64 R66 R69-R77 R79-R87 R90 R94-R96 = BBox01:R0402
SD1 = BBox02:SD_CARD
SW1 = BBox02:SWITH_NO
SW2 = BBox02:SWITCH_TOG_RA
SW3 = BBox02:SW_PBUTTON_RA
T1-T8 T12 T13 = HO3:TESTP_SM
TP1-TP7 TP14 TP16 TP17 TP24 = BBox02:TP_THSM2
TP8-TP10 TP18-TP23 TP25-TP27 TP29 TP31 TP32 TP41-TP43 TP46 = BBox02:TP_SMT
TP11-TP13 TP15 = BBox02:TP_THSM
U1-U5 U10 = BBox02:LTC4053
U6 = BBox02:HUMIDITY_A
U7 = BBox02:VOLT_SUPR
U8 = BBox02:FLIGHTSENSE_L5
U11 = BBox02:VREG_SW_LM2677
U12 = BBox02:SRAM_16M_2X16
U13 = BBox02:ALS
U15 = BBox01:UBLOX_M8
U16 = heka:BEAD
U17 = BBox02:FLASH_SPI
U18 = HO2:VREG_23B
U19 = BBox01:LTC1998
U20 = BBox02:ALTIMETER_TEC
U24 = BBox02:ATTINY_817_QFN
U$1 = BBox02:LCD_3V_SMALL
U$5 = stm32:STM32H743ZIT6
X1 = BBox02:XTAL_SMALL
X2 = BBox02:TCXO_32K_BGA